# EAGLE schematic Front_Unit_5.4 (EAGLE 9.6.2), part 1 of 3
Assembly variants: A, B, C
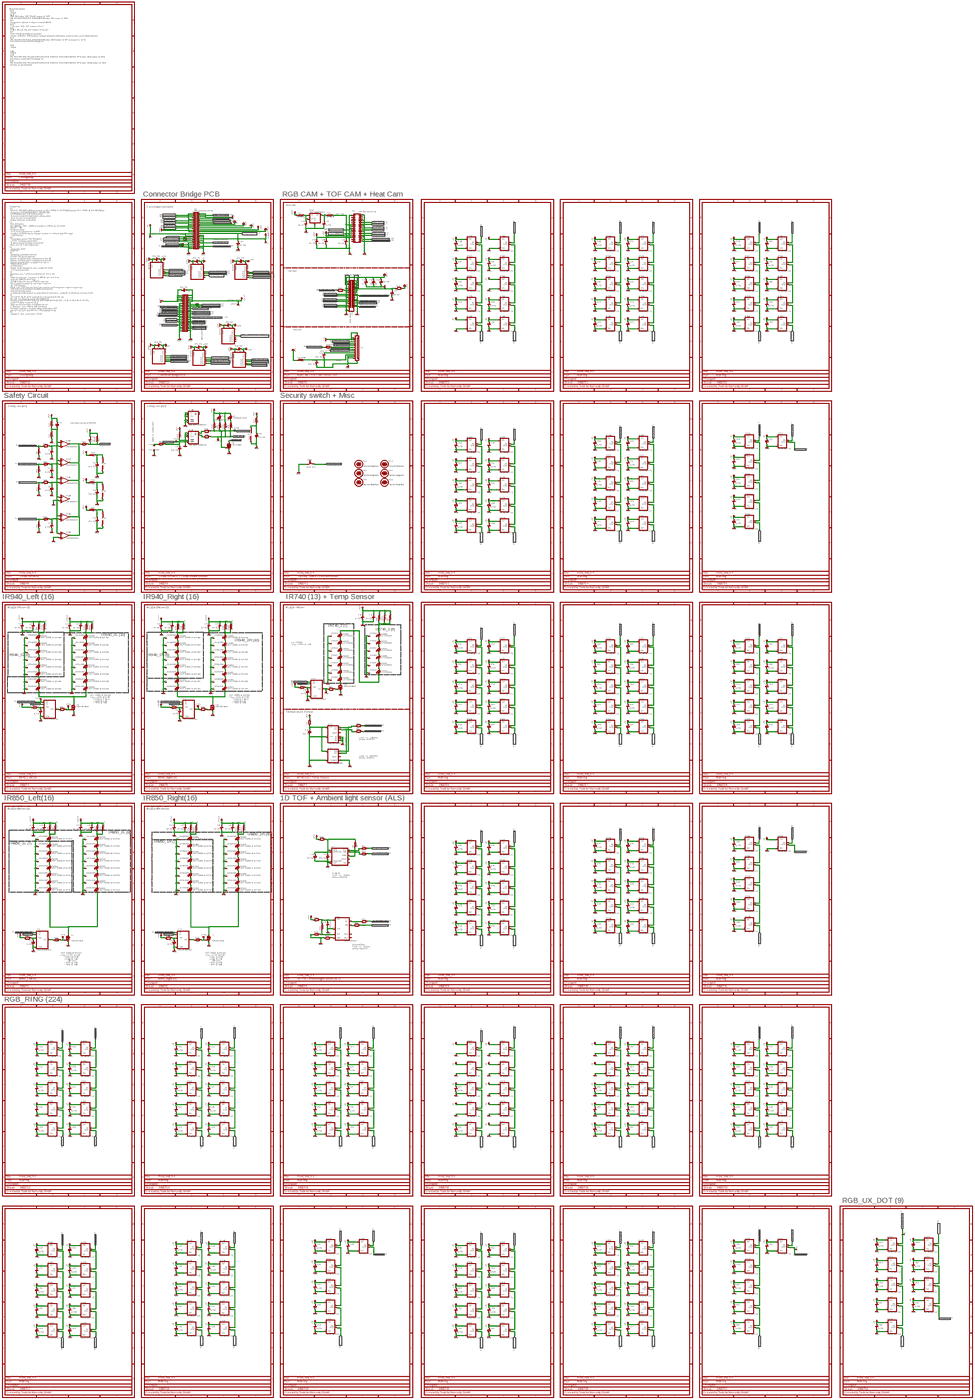
[diagram p0: schematic, sheet 1, overview]
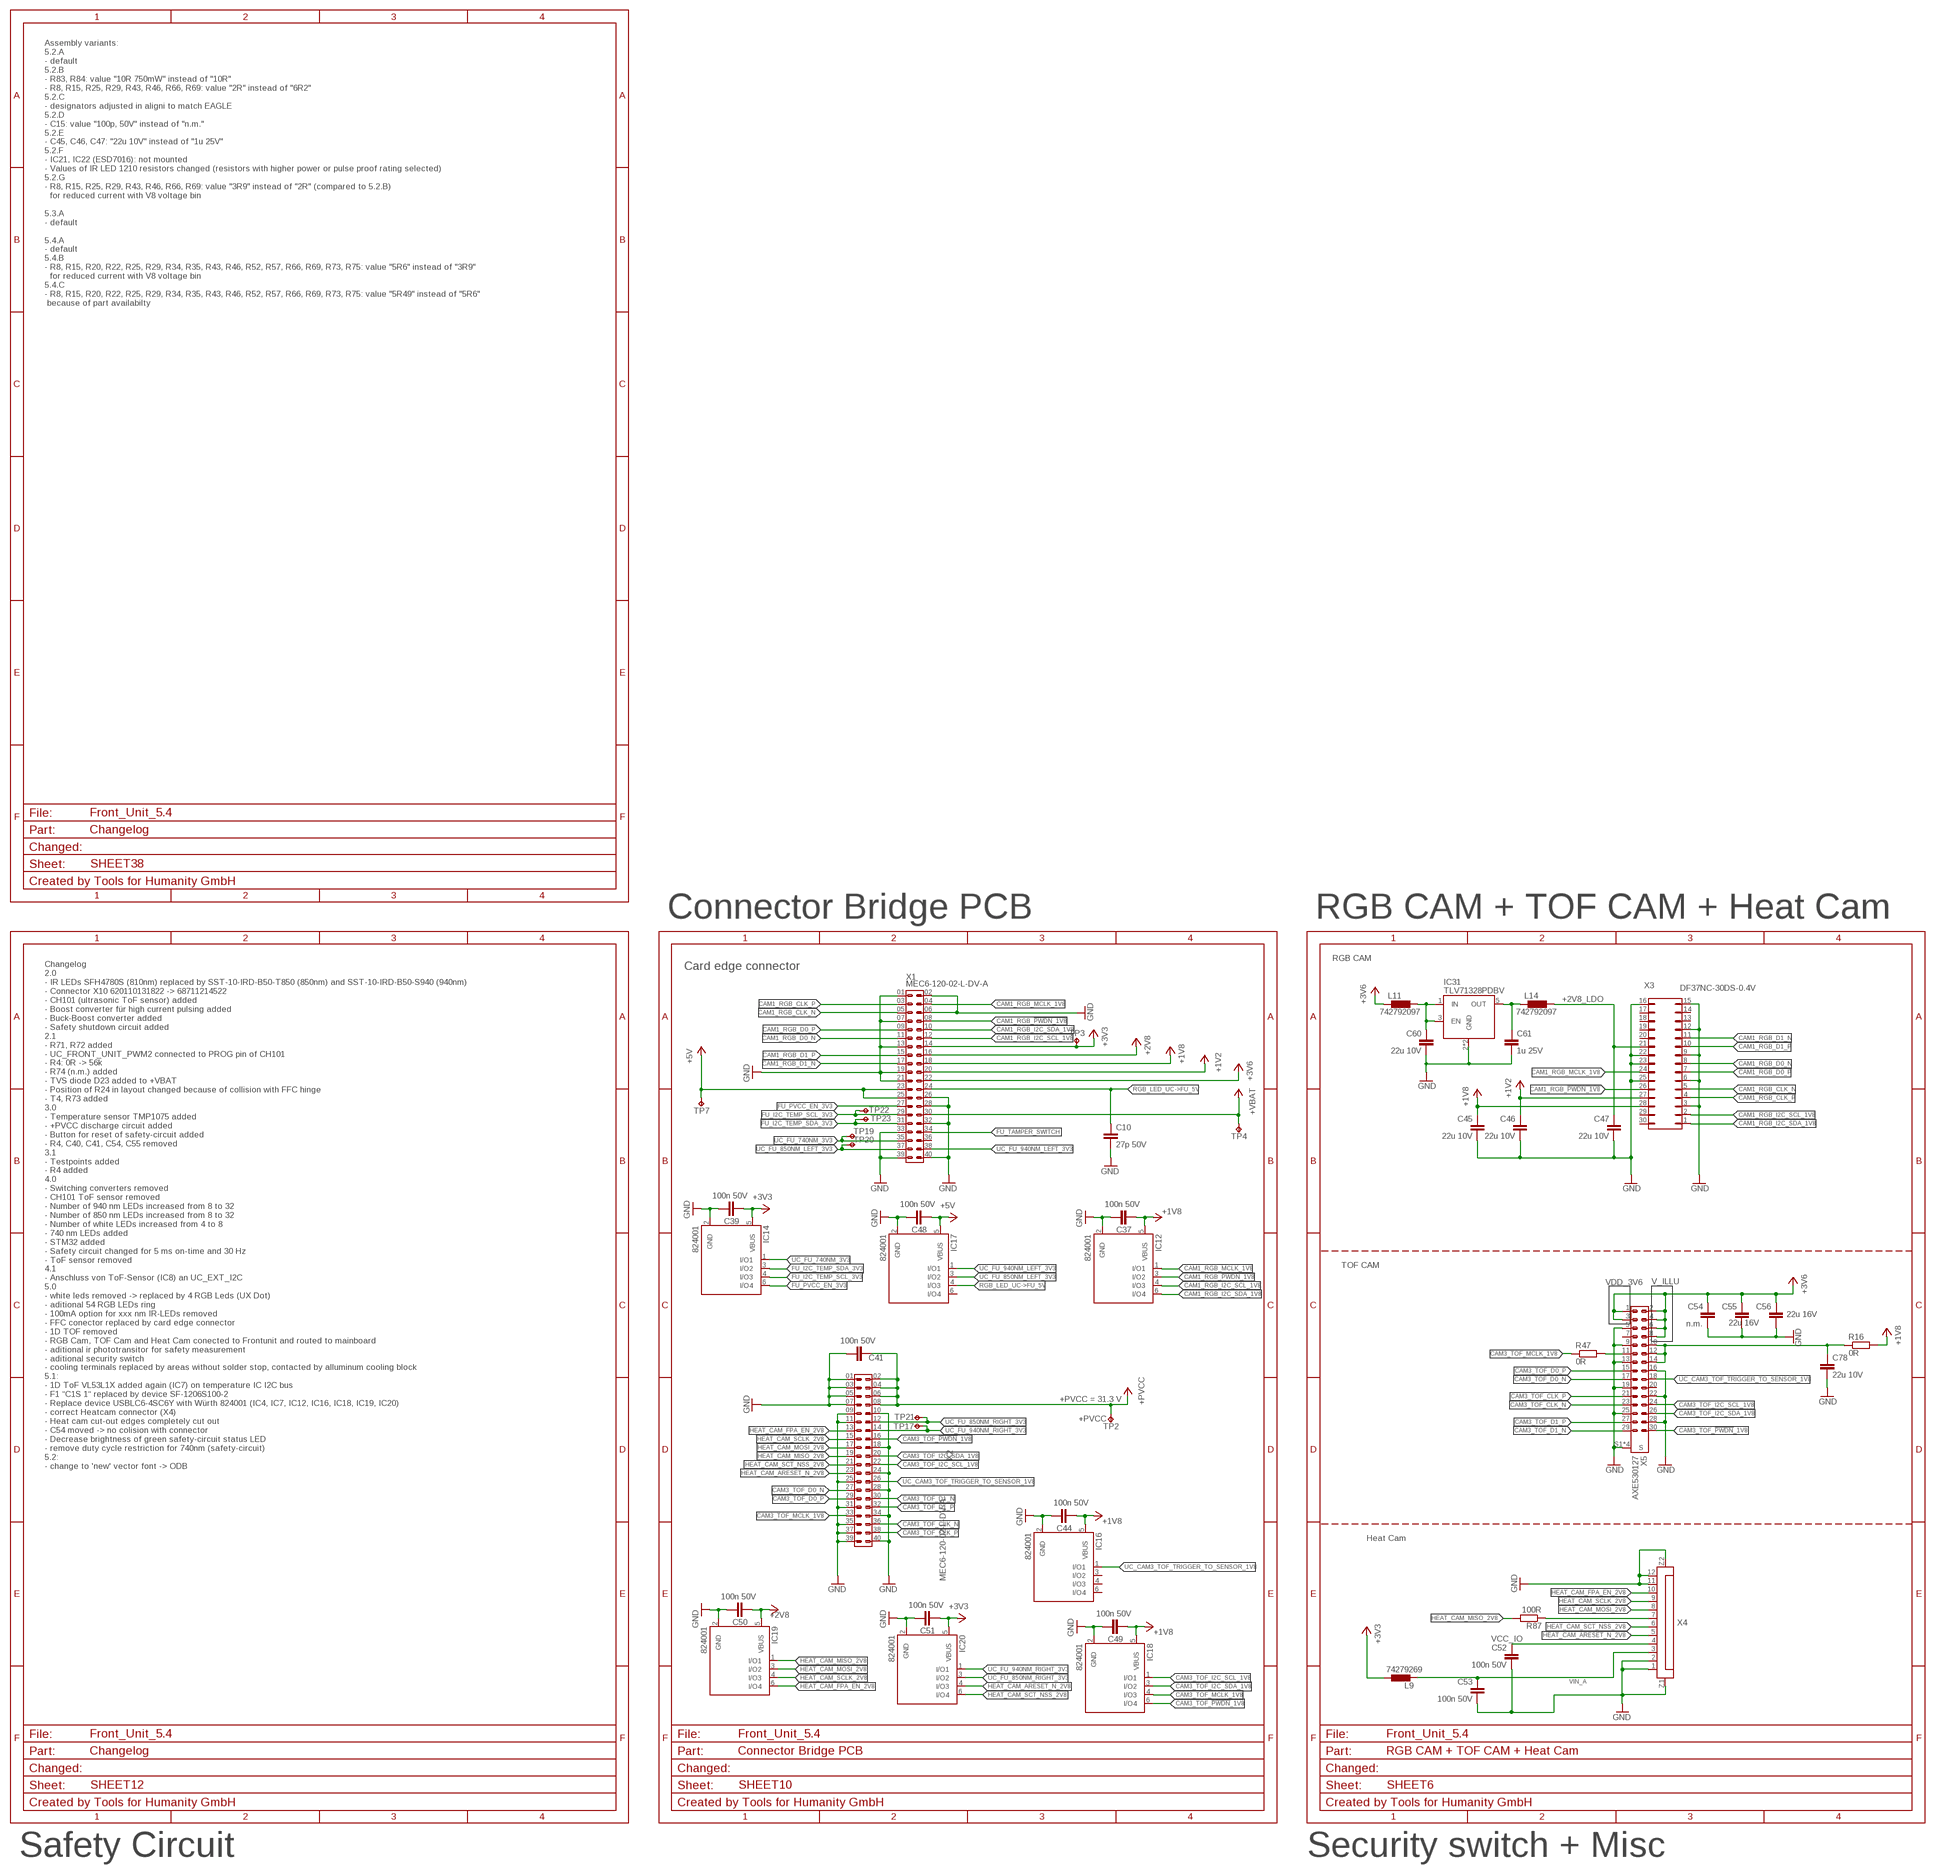
[diagram p1: schematic, sheet 1, part 1 of 8]
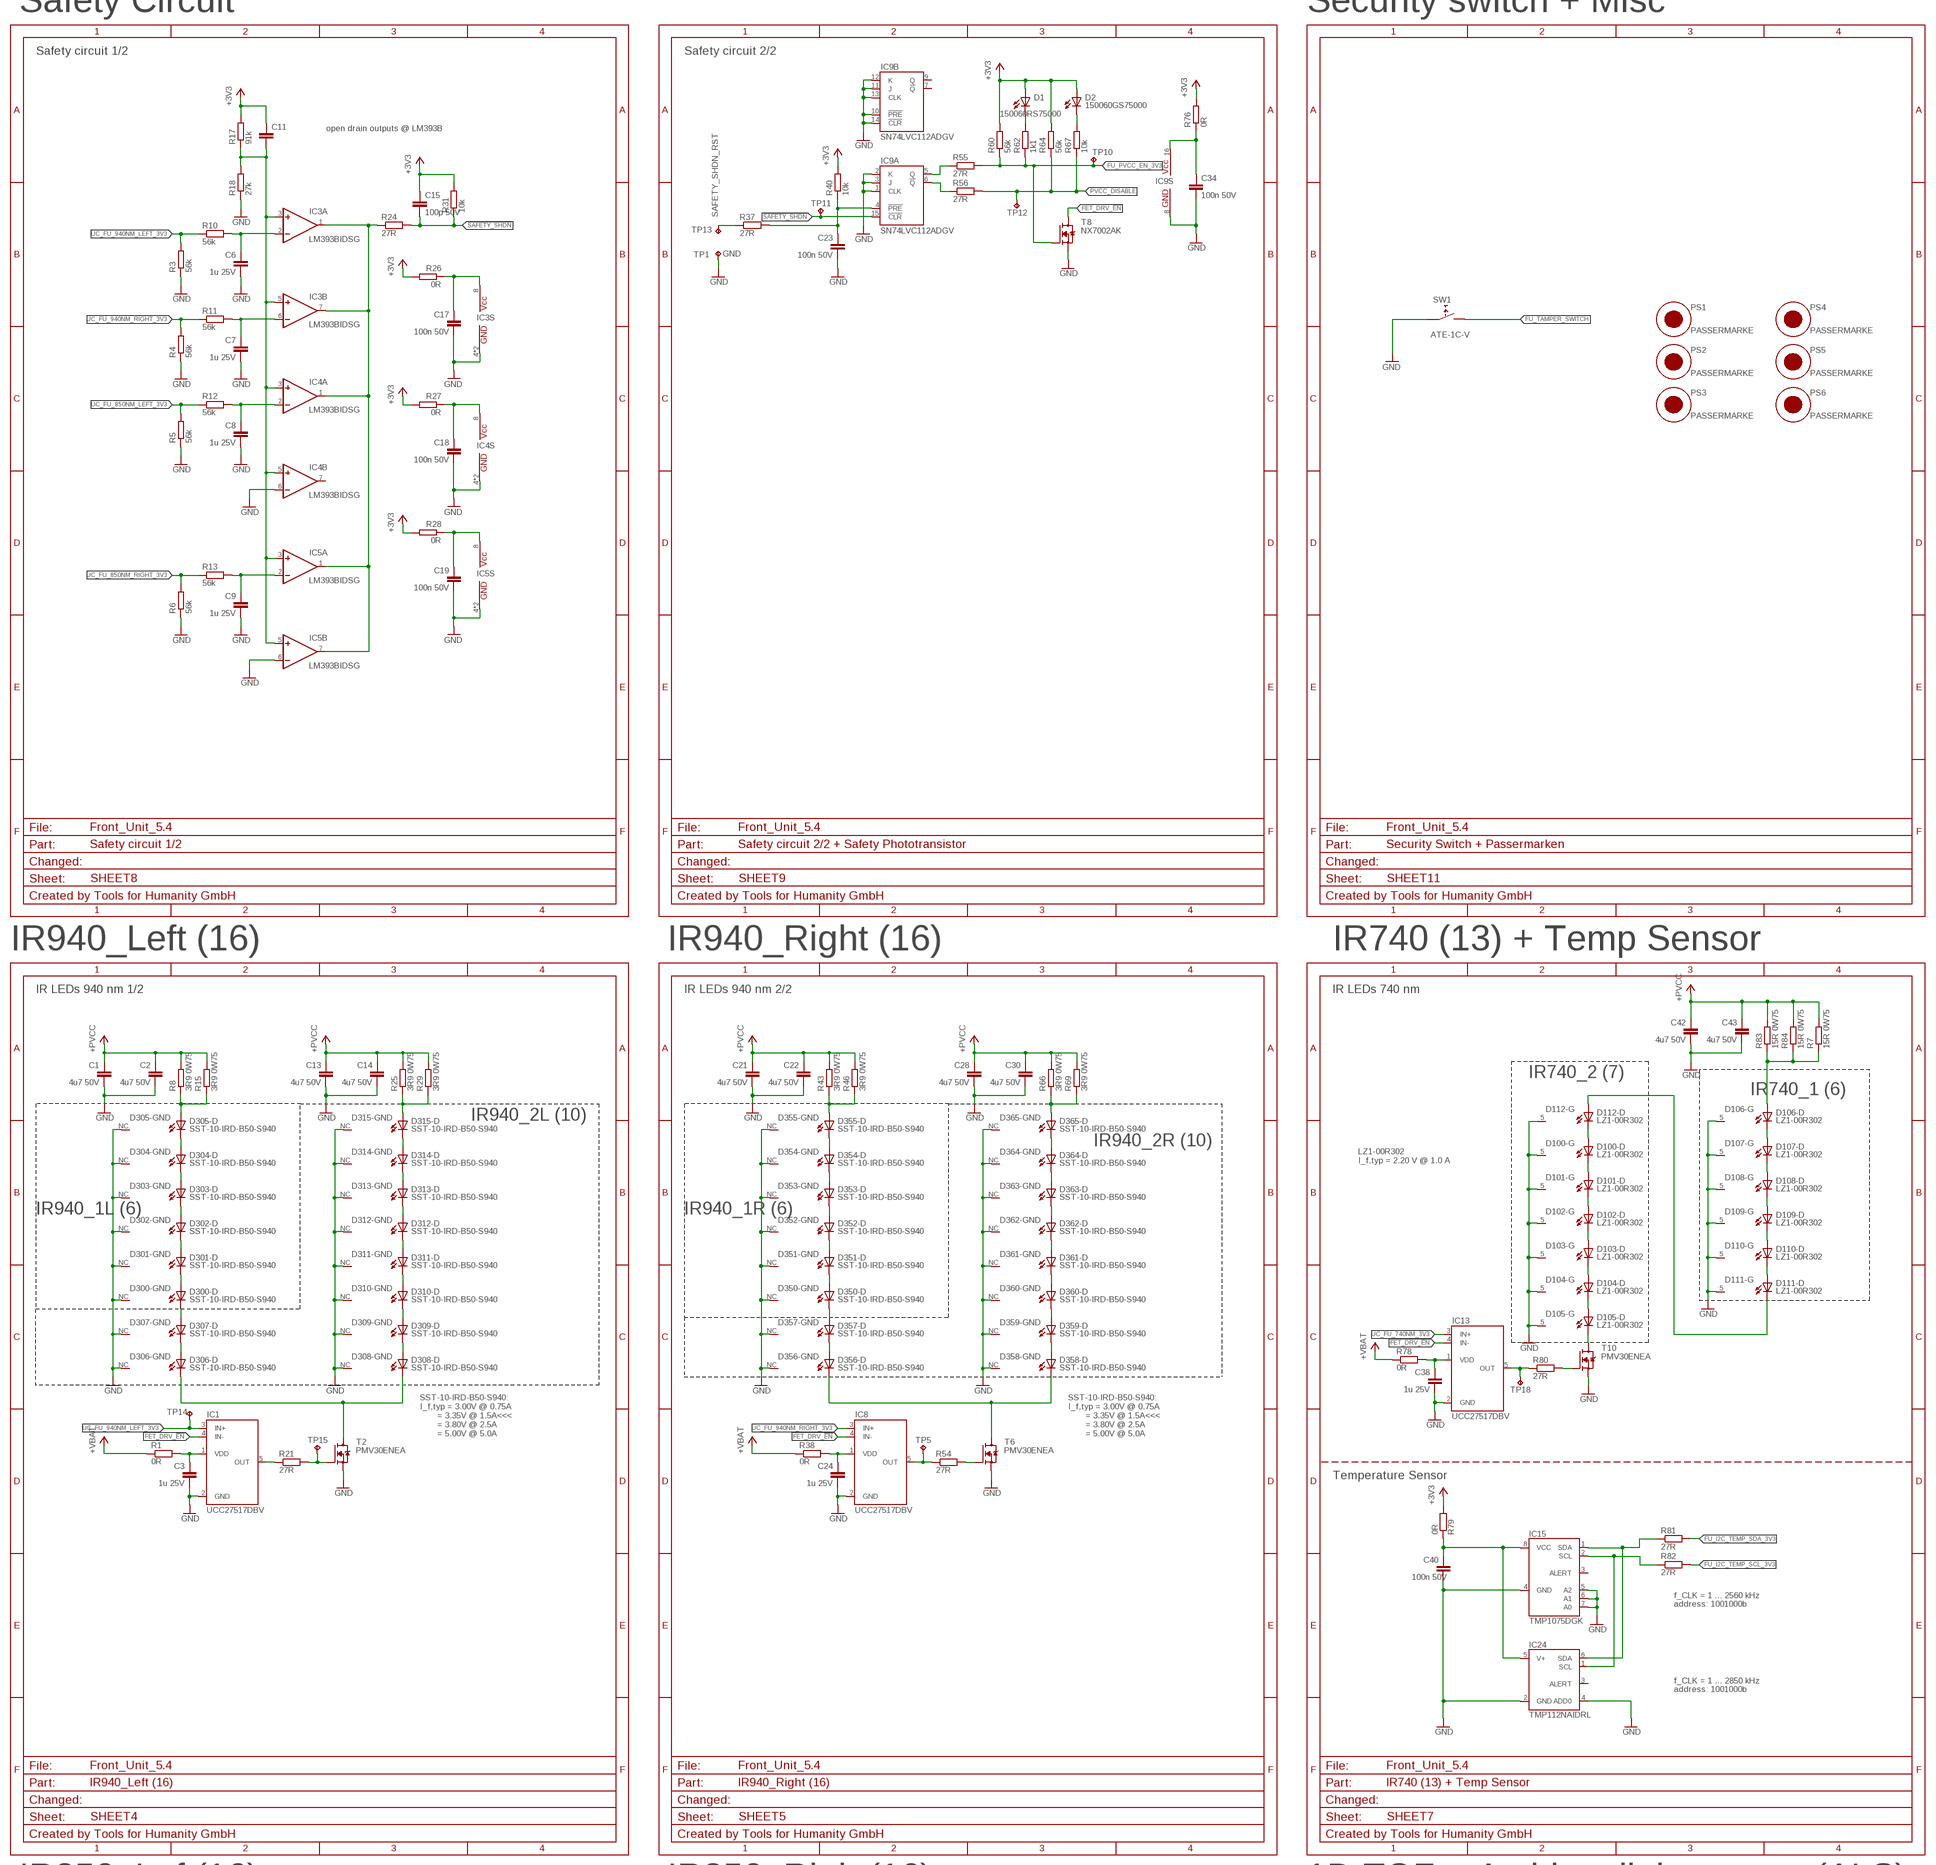
[diagram p2: schematic, sheet 1, part 2 of 8]
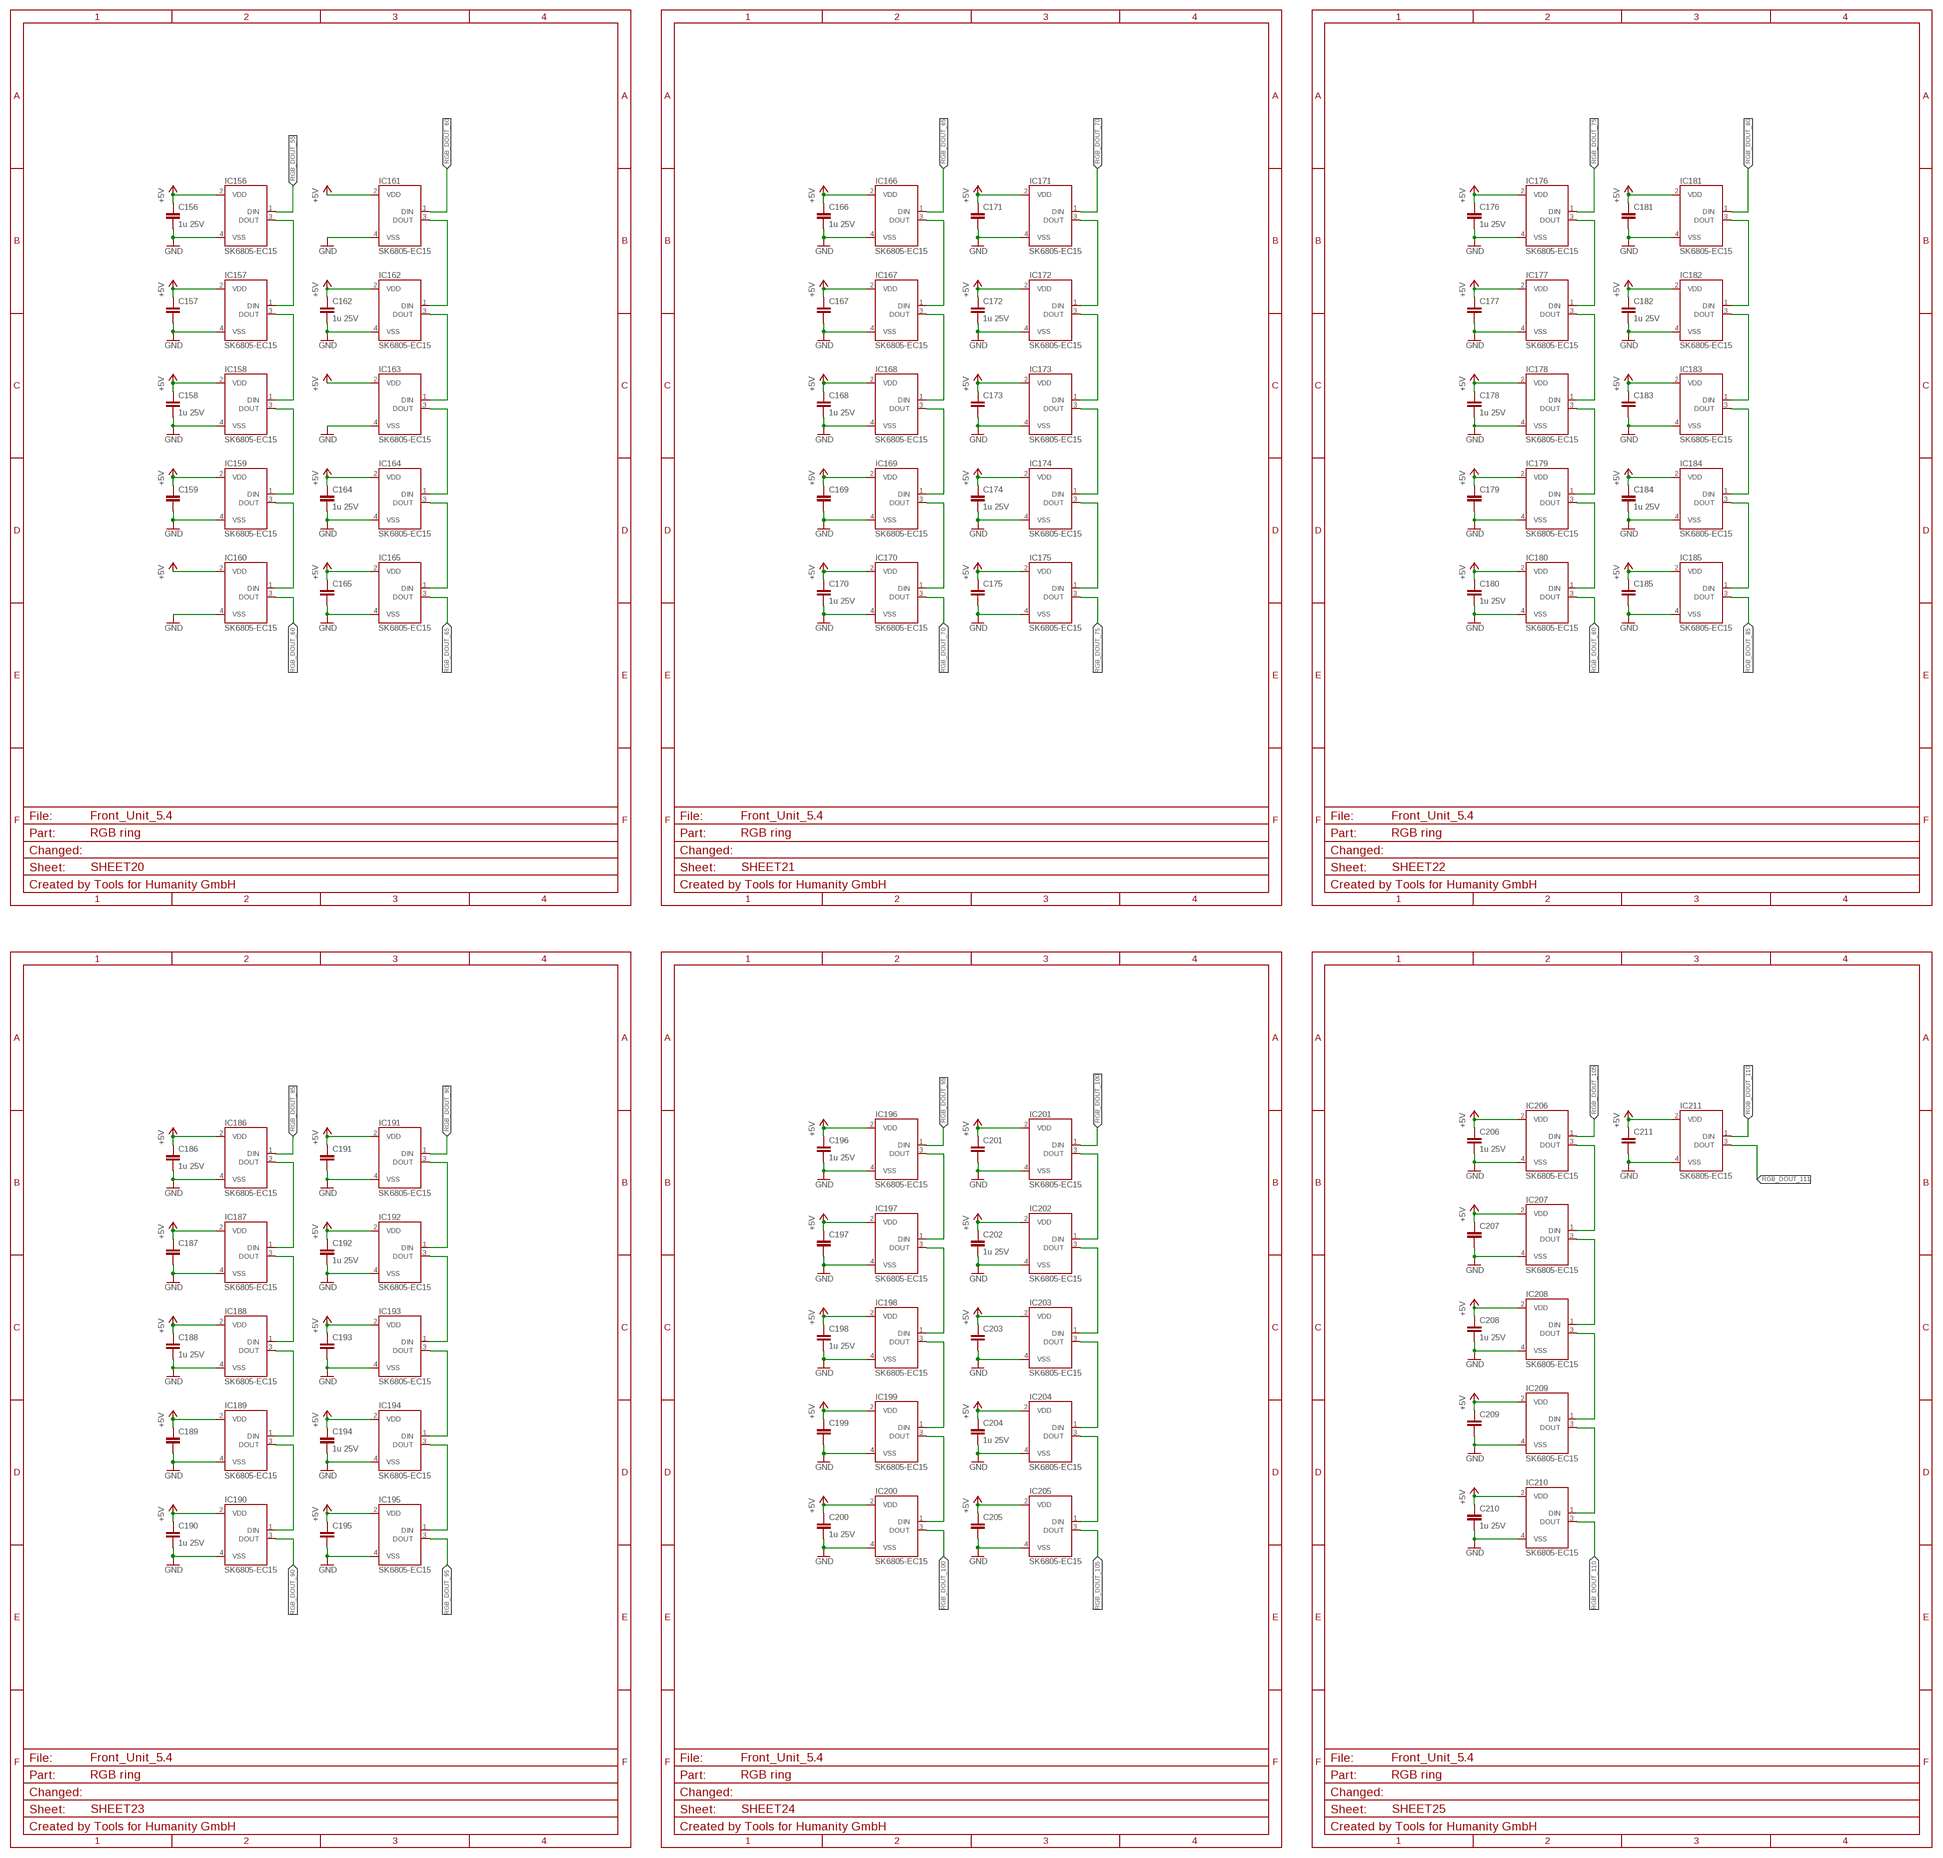
[diagram p3: schematic, sheet 1, part 3 of 8]
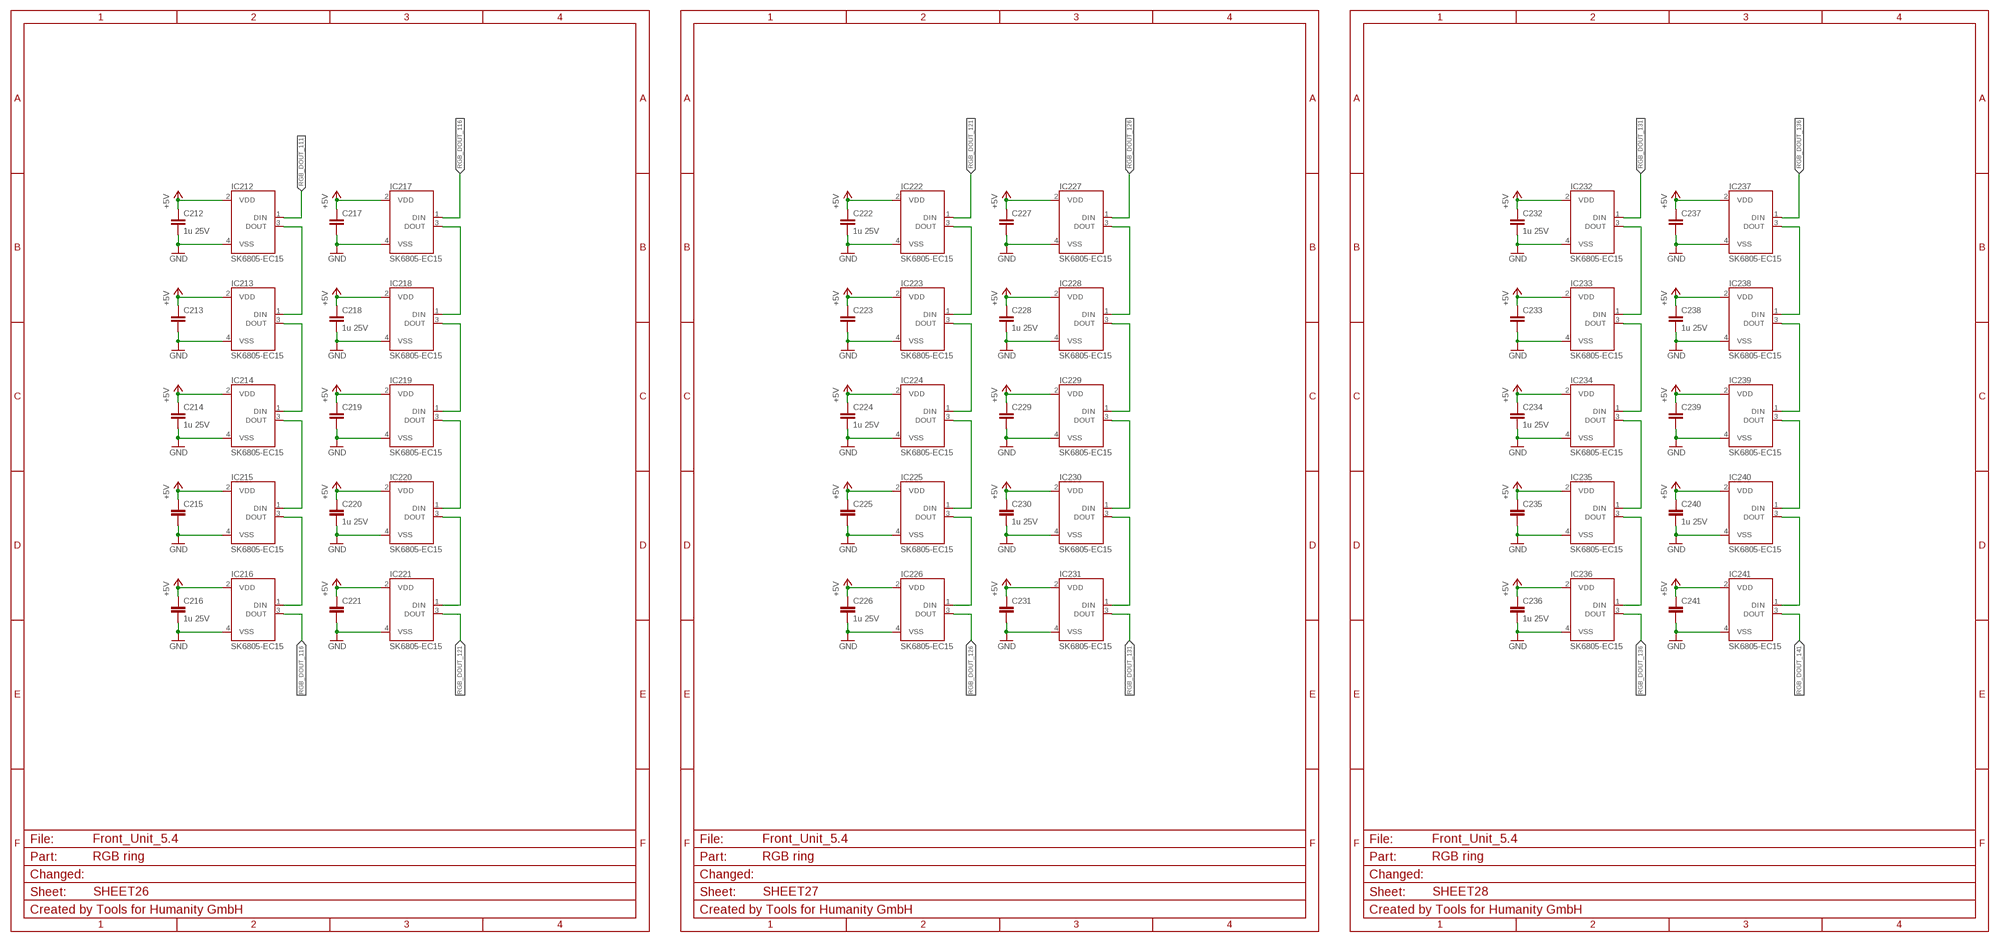
[diagram p4: schematic, sheet 1, part 4 of 8]
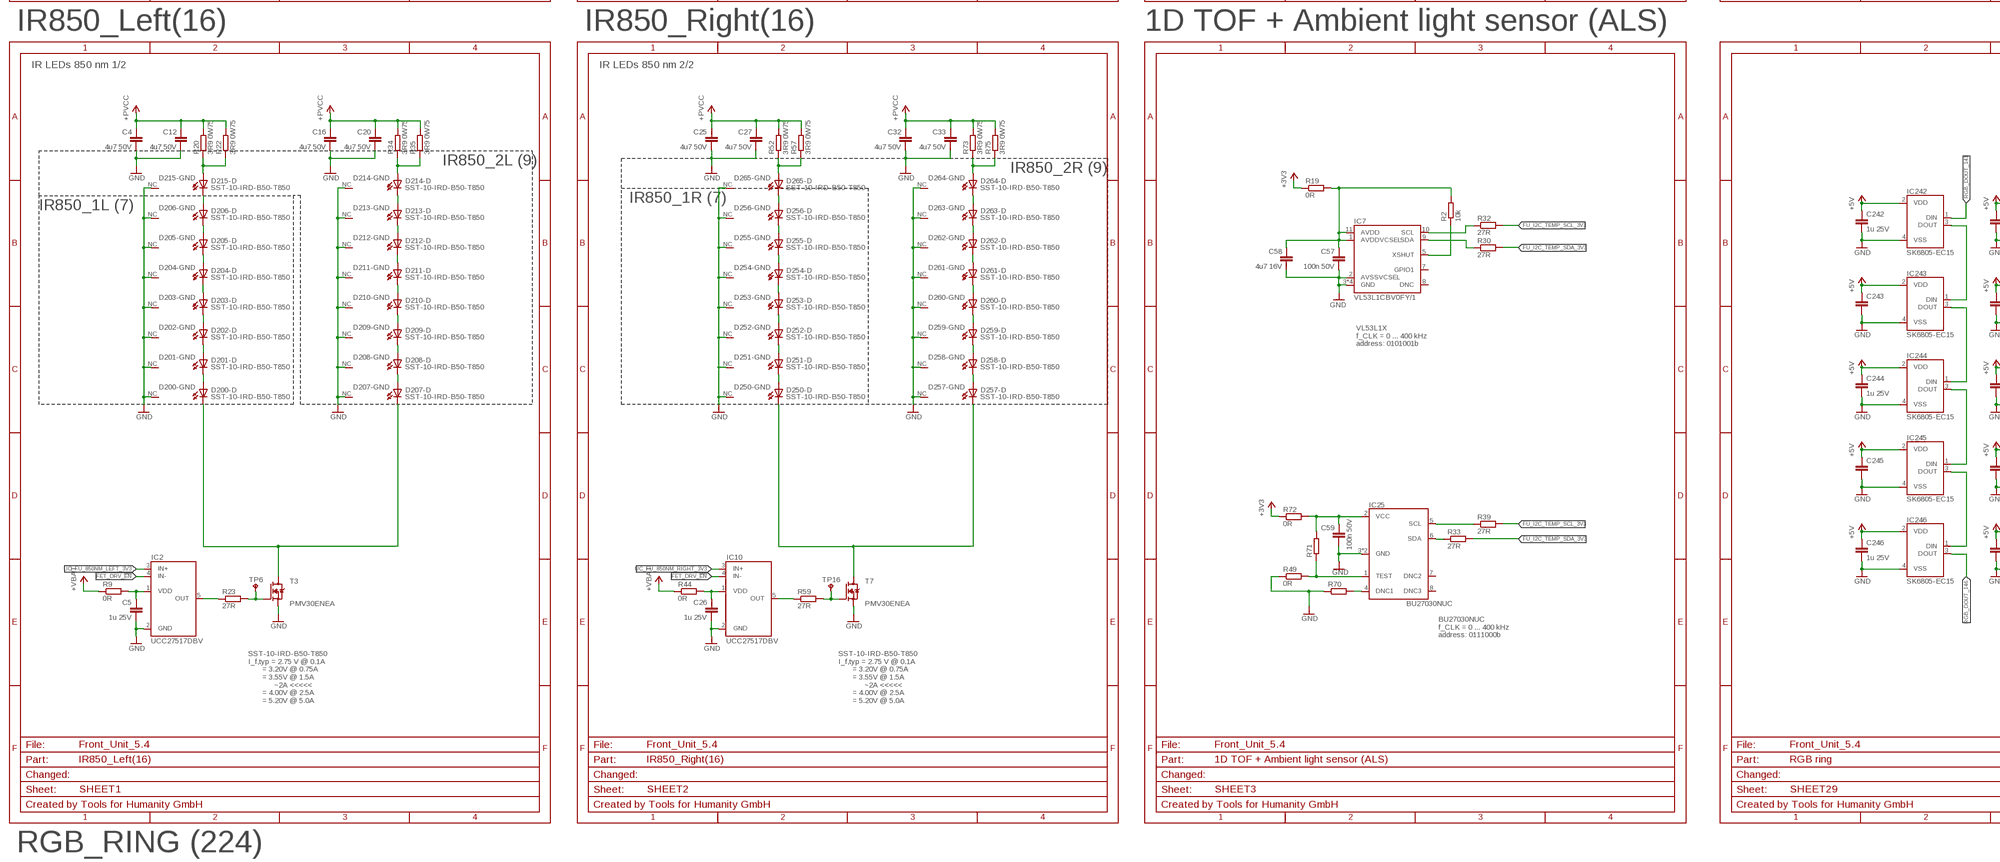
[diagram p5: schematic, sheet 1, part 5 of 8]
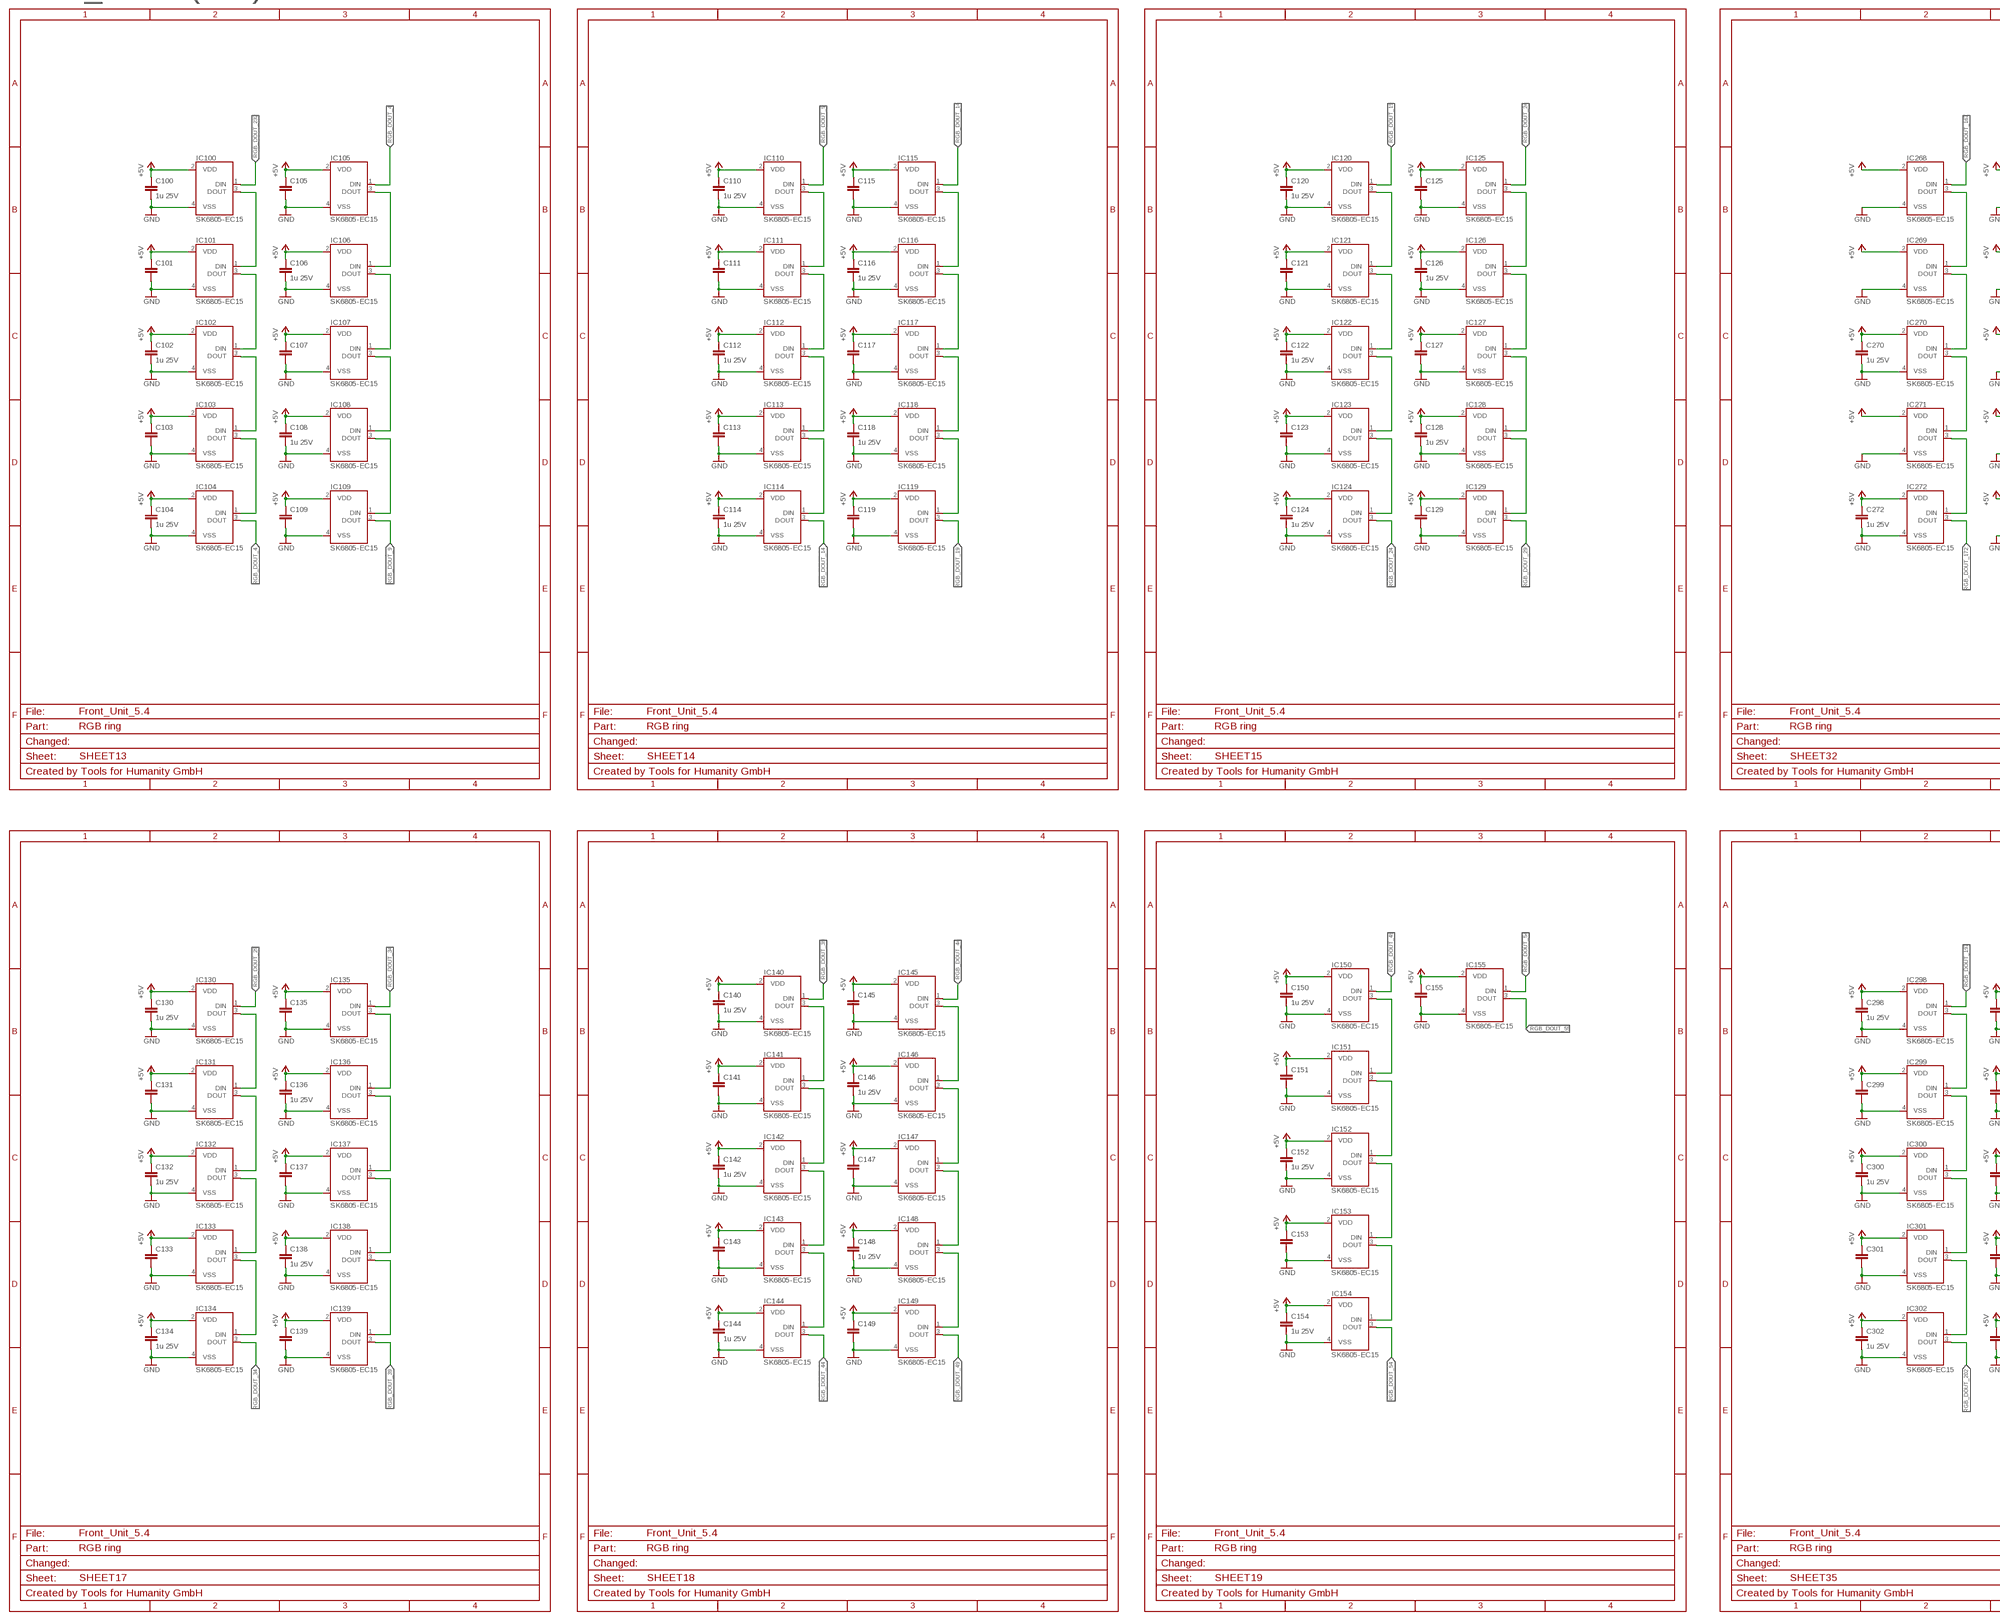
[diagram p6: schematic, sheet 1, part 6 of 8]
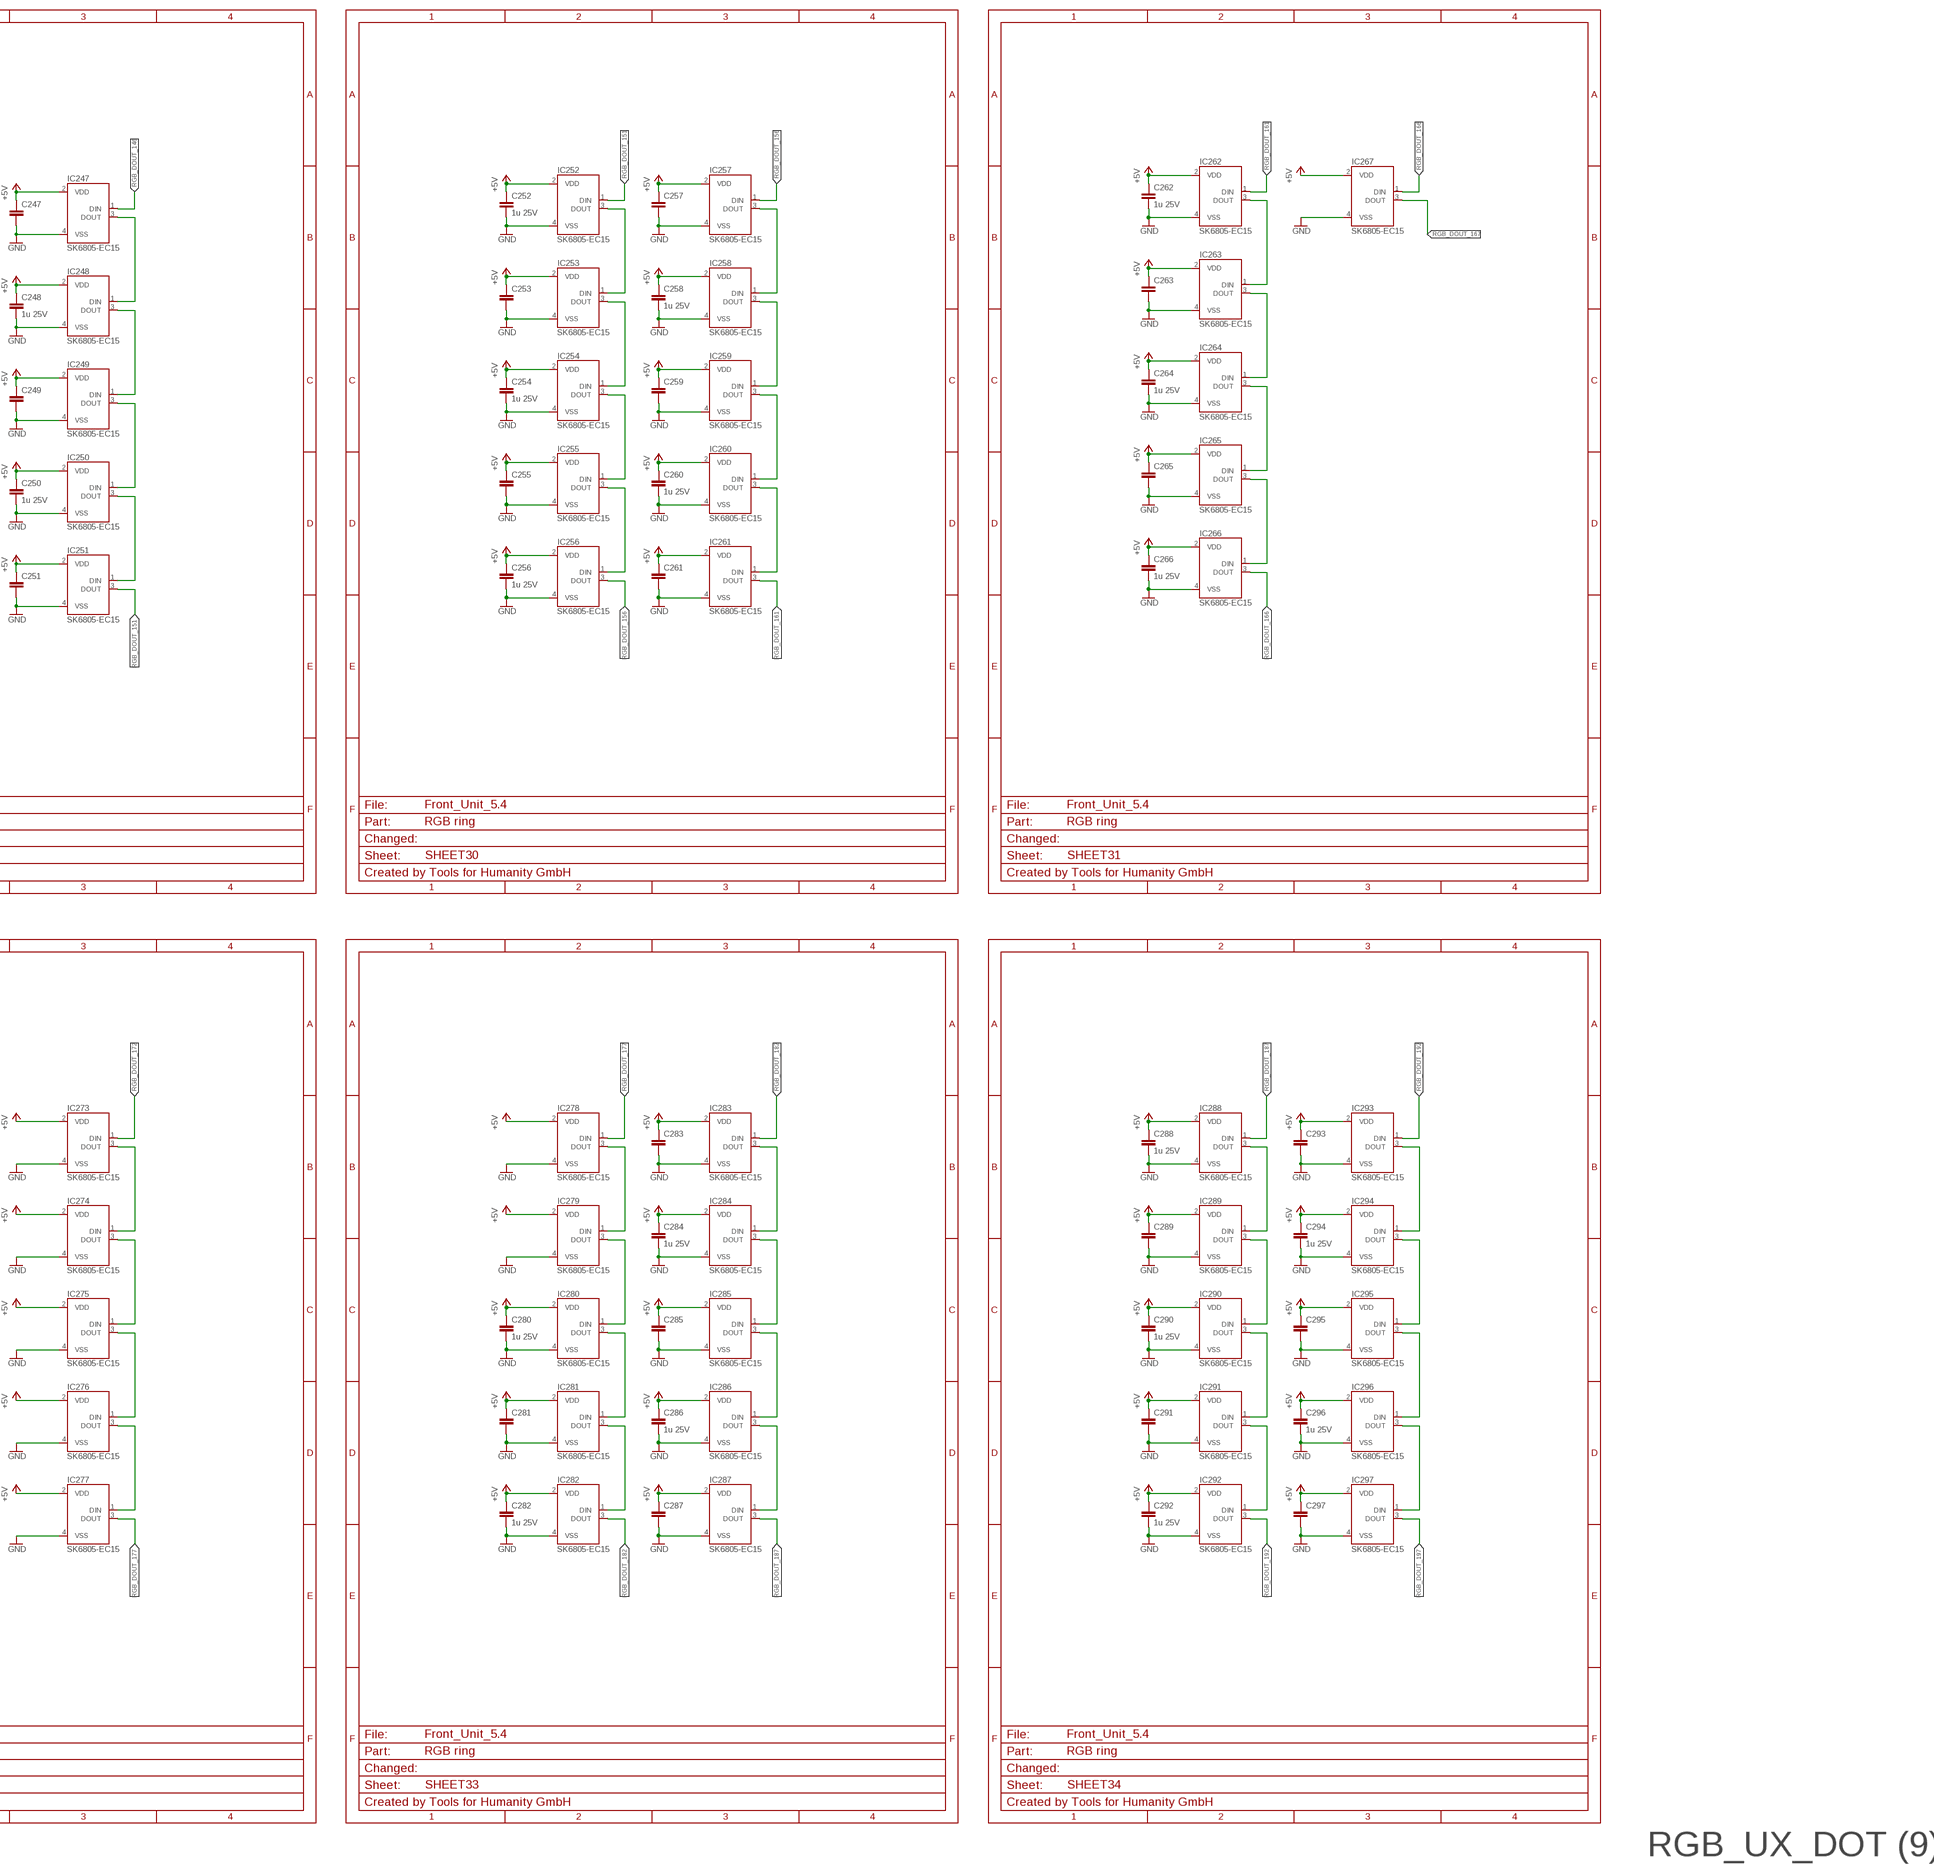
[diagram p7: schematic, sheet 1, part 7 of 8]
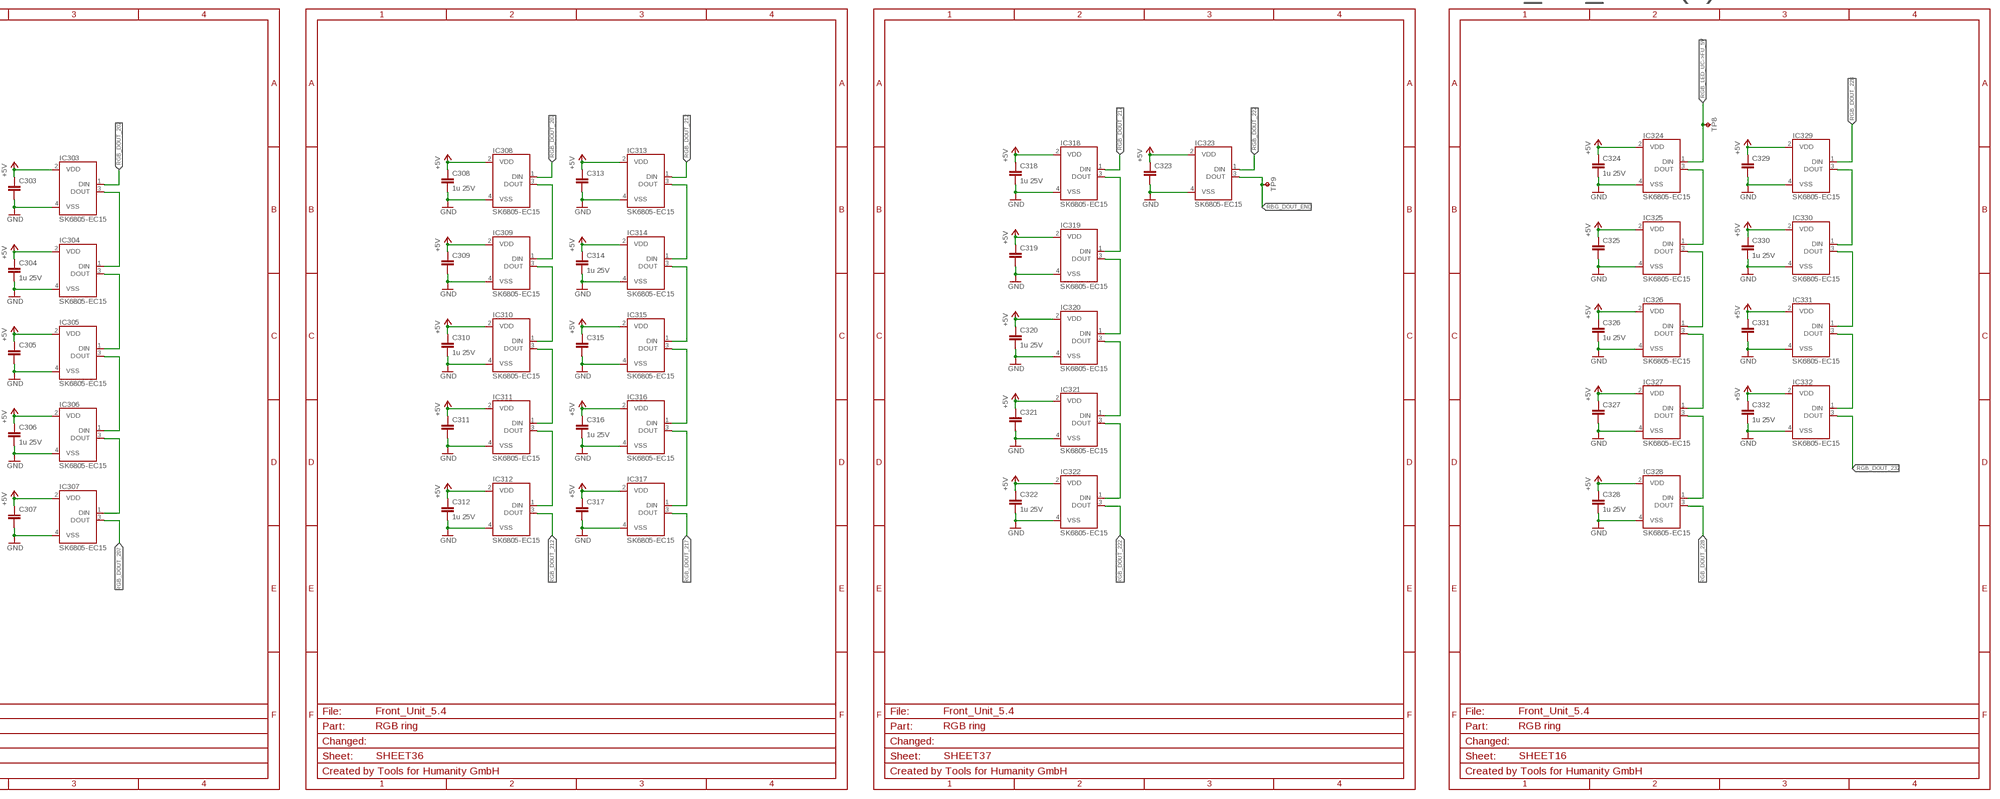
[diagram p8: schematic, sheet 1, part 8 of 8]

## Parts
C1  4u7 50V  C-EU-4U7-50V-C1210  [C1210]
C2  4u7 50V  C-EU-4U7-50V-C1210  [C1210]
C3  1u 25V  C-EU-1U-C0805  [C0805]
C4  4u7 50V  C-EU-4U7-50V-C1210  [C1210]
C5  1u 25V  C-EU-1U-C0805  [C0805]
C6  1u 25V  C-EU-1U-C0805  [C0805]
C7  1u 25V  C-EU-1U-C0805  [C0805]
C8  1u 25V  C-EU-1U-C0805  [C0805]
C9  1u 25V  C-EU-1U-C0805  [C0805]
C10  27p 50V  C-EU-27P-C0603  [C0603]
C11  C-EU-C0603  [C0603]  (not fitted in variant A)  (not fitted in variant B)  (not fitted in variant C)
C12  4u7 50V  C-EU-4U7-50V-C1210  [C1210]
C13  4u7 50V  C-EU-4U7-50V-C1210  [C1210]
C14  4u7 50V  C-EU-4U7-50V-C1210  [C1210]
C15  100p 50V  C-EU-100P-C0603  [C0603]
C16  4u7 50V  C-EU-4U7-50V-C1210  [C1210]
C17  100n 50V  C-EU-100N-C0603  [C0603]
C18  100n 50V  C-EU-100N-C0603  [C0603]
C19  100n 50V  C-EU-100N-C0603  [C0603]
C20  4u7 50V  C-EU-4U7-50V-C1210  [C1210]
C21  4u7 50V  C-EU-4U7-50V-C1210  [C1210]
C22  4u7 50V  C-EU-4U7-50V-C1210  [C1210]
C23  100n 50V  C-EU-100N-C0603  [C0603]
C24  1u 25V  C-EU-1U-C0805  [C0805]
C25  4u7 50V  C-EU-4U7-50V-C1210  [C1210]
C26  1u 25V  C-EU-1U-C0805  [C0805]
C27  4u7 50V  C-EU-4U7-50V-C1210  [C1210]
C28  4u7 50V  C-EU-4U7-50V-C1210  [C1210]
C30  4u7 50V  C-EU-4U7-50V-C1210  [C1210]
C32  4u7 50V  C-EU-4U7-50V-C1210  [C1210]
C33  4u7 50V  C-EU-4U7-50V-C1210  [C1210]
C34  100n 50V  C-EU-100N-C0603  [C0603]
C37  100n 50V  C-EU-100N-C0603  [C0603]
C38  1u 25V  C-EU-1U-C0805  [C0805]
C39  100n 50V  C-EU-100N-C0603  [C0603]
C40  100n 50V  C-EU-100N-C0603  [C0603]
C41  100n 50V  C-EU-100N-C0603  [C0603]
C42  4u7 50V  C-EU-4U7-50V-C1210  [C1210]
C43  4u7 50V  C-EU-4U7-50V-C1210  [C1210]
C44  100n 50V  C-EU-100N-C0603  [C0603]
C45  22u 10V  C-EU-22U-C0805  [C0805]
C46  22u 10V  C-EU-22U-C0805  [C0805]
C47  22u 10V  C-EU-22U-C0805  [C0805]
C48  100n 50V  C-EU-100N-C0603  [C0603]
C49  100n 50V  C-EU-100N-C0603  [C0603]
C50  100n 50V  C-EU-100N-C0603  [C0603]
C51  100n 50V  C-EU-100N-C0603  [C0603]
C52  100n 50V  C-EU-100N-C0603  [C0603]
C53  100n 50V  C-EU-100N-C0603  [C0603]
C54  n.m.  C-EU-C1206  [C1206]  (not fitted in variant A)  (not fitted in variant B)  (not fitted in variant C)
C55  22u 16V  C-EU-22U-C1206  [C1206]
C56  22u 16V  C-EU-22U-C1206  [C1206]
C57  100n 50V  C-EU-100N-C0603  [C0603]
C58  4u7 16V  C-EU-4U7-C0805  [C0805]
C59  100n 50V  C-EU-100N-C0603  [C0603]
C60  22u 10V  C-EU-22U-C0805  [C0805]
C61  1u 25V  C-EU-1U-C0603  [C0603]
C78  22u 10V  C-EU-22U-C0805  [C0805]
C100  1u 25V  C-EU-1U-C0603  [C0603]
C101  C-EU-C0603  [C0603]  (not fitted in variant A)  (not fitted in variant B)  (not fitted in variant C)
C102  1u 25V  C-EU-1U-C0603  [C0603]
C103  C-EU-C0603  [C0603]  (not fitted in variant A)  (not fitted in variant B)  (not fitted in variant C)
C104  1u 25V  C-EU-1U-C0603  [C0603]
C105  C-EU-C0603  [C0603]  (not fitted in variant A)  (not fitted in variant B)  (not fitted in variant C)
C106  1u 25V  C-EU-1U-C0603  [C0603]
C107  C-EU-C0603  [C0603]  (not fitted in variant A)  (not fitted in variant B)  (not fitted in variant C)
C108  1u 25V  C-EU-1U-C0603  [C0603]
C109  C-EU-C0603  [C0603]  (not fitted in variant A)  (not fitted in variant B)  (not fitted in variant C)
C110  1u 25V  C-EU-1U-C0603  [C0603]
C111  C-EU-C0603  [C0603]  (not fitted in variant A)  (not fitted in variant B)  (not fitted in variant C)
C112  1u 25V  C-EU-1U-C0603  [C0603]
C113  C-EU-C0603  [C0603]  (not fitted in variant A)  (not fitted in variant B)  (not fitted in variant C)
C114  1u 25V  C-EU-1U-C0603  [C0603]
C115  C-EU-C0603  [C0603]  (not fitted in variant A)  (not fitted in variant B)  (not fitted in variant C)
C116  1u 25V  C-EU-1U-C0603  [C0603]
C117  C-EU-C0603  [C0603]  (not fitted in variant A)  (not fitted in variant B)  (not fitted in variant C)
C118  1u 25V  C-EU-1U-C0603  [C0603]
C119  C-EU-C0603  [C0603]  (not fitted in variant A)  (not fitted in variant B)  (not fitted in variant C)
C120  1u 25V  C-EU-1U-C0603  [C0603]
C121  C-EU-C0603  [C0603]  (not fitted in variant A)  (not fitted in variant B)  (not fitted in variant C)
C122  1u 25V  C-EU-1U-C0603  [C0603]
C123  C-EU-C0603  [C0603]  (not fitted in variant A)  (not fitted in variant B)  (not fitted in variant C)
C124  1u 25V  C-EU-1U-C0603  [C0603]
C125  C-EU-C0603  [C0603]  (not fitted in variant A)  (not fitted in variant B)  (not fitted in variant C)
C126  1u 25V  C-EU-1U-C0603  [C0603]
C127  C-EU-C0603  [C0603]  (not fitted in variant A)  (not fitted in variant B)  (not fitted in variant C)
C128  1u 25V  C-EU-1U-C0603  [C0603]
C129  C-EU-C0603  [C0603]  (not fitted in variant A)  (not fitted in variant B)  (not fitted in variant C)
C130  1u 25V  C-EU-1U-C0603  [C0603]
C131  C-EU-C0603  [C0603]  (not fitted in variant A)  (not fitted in variant B)  (not fitted in variant C)
C132  1u 25V  C-EU-1U-C0603  [C0603]
C133  C-EU-C0603  [C0603]  (not fitted in variant A)  (not fitted in variant B)  (not fitted in variant C)
C134  1u 25V  C-EU-1U-C0603  [C0603]
C135  C-EU-C0603  [C0603]  (not fitted in variant A)  (not fitted in variant B)  (not fitted in variant C)
C136  1u 25V  C-EU-1U-C0603  [C0603]
C137  C-EU-C0603  [C0603]  (not fitted in variant A)  (not fitted in variant B)  (not fitted in variant C)
C138  1u 25V  C-EU-1U-C0603  [C0603]
C139  C-EU-C0603  [C0603]  (not fitted in variant A)  (not fitted in variant B)  (not fitted in variant C)
C140  1u 25V  C-EU-1U-C0603  [C0603]
C141  C-EU-C0603  [C0603]  (not fitted in variant A)  (not fitted in variant B)  (not fitted in variant C)
C142  1u 25V  C-EU-1U-C0603  [C0603]
C143  C-EU-C0603  [C0603]  (not fitted in variant A)  (not fitted in variant B)  (not fitted in variant C)
C144  1u 25V  C-EU-1U-C0603  [C0603]
C145  C-EU-C0603  [C0603]  (not fitted in variant A)  (not fitted in variant B)  (not fitted in variant C)
C146  1u 25V  C-EU-1U-C0603  [C0603]
C147  C-EU-C0603  [C0603]  (not fitted in variant A)  (not fitted in variant B)  (not fitted in variant C)
C148  1u 25V  C-EU-1U-C0603  [C0603]
C149  C-EU-C0603  [C0603]  (not fitted in variant A)  (not fitted in variant B)  (not fitted in variant C)
C150  1u 25V  C-EU-1U-C0603  [C0603]
C151  C-EU-C0603  [C0603]  (not fitted in variant A)  (not fitted in variant B)  (not fitted in variant C)
C152  1u 25V  C-EU-1U-C0603  [C0603]
C153  C-EU-C0603  [C0603]  (not fitted in variant A)  (not fitted in variant B)  (not fitted in variant C)
C154  1u 25V  C-EU-1U-C0603  [C0603]
C155  C-EU-C0603  [C0603]  (not fitted in variant A)  (not fitted in variant B)  (not fitted in variant C)
C156  1u 25V  C-EU-1U-C0603  [C0603]
C157  C-EU-C0603  [C0603]  (not fitted in variant A)  (not fitted in variant B)  (not fitted in variant C)
C158  1u 25V  C-EU-1U-C0603  [C0603]
C159  C-EU-C0603  [C0603]  (not fitted in variant A)  (not fitted in variant B)  (not fitted in variant C)
C162  1u 25V  C-EU-1U-C0603  [C0603]
C164  1u 25V  C-EU-1U-C0603  [C0603]
C165  C-EU-C0603  [C0603]  (not fitted in variant A)  (not fitted in variant B)  (not fitted in variant C)
C166  1u 25V  C-EU-1U-C0603  [C0603]
C167  C-EU-C0603  [C0603]  (not fitted in variant A)  (not fitted in variant B)  (not fitted in variant C)
C168  1u 25V  C-EU-1U-C0603  [C0603]
C169  C-EU-C0603  [C0603]  (not fitted in variant A)  (not fitted in variant B)  (not fitted in variant C)
C170  1u 25V  C-EU-1U-C0603  [C0603]
C171  C-EU-C0603  [C0603]  (not fitted in variant A)  (not fitted in variant B)  (not fitted in variant C)
C172  1u 25V  C-EU-1U-C0603  [C0603]
C173  C-EU-C0603  [C0603]  (not fitted in variant A)  (not fitted in variant B)  (not fitted in variant C)
C174  1u 25V  C-EU-1U-C0603  [C0603]
C175  C-EU-C0603  [C0603]  (not fitted in variant A)  (not fitted in variant B)  (not fitted in variant C)
C176  1u 25V  C-EU-1U-C0603  [C0603]
C177  C-EU-C0603  [C0603]  (not fitted in variant A)  (not fitted in variant B)  (not fitted in variant C)
C178  1u 25V  C-EU-1U-C0603  [C0603]
C179  C-EU-C0603  [C0603]  (not fitted in variant A)  (not fitted in variant B)  (not fitted in variant C)
C180  1u 25V  C-EU-1U-C0603  [C0603]
C181  C-EU-C0603  [C0603]  (not fitted in variant A)  (not fitted in variant B)  (not fitted in variant C)
C182  1u 25V  C-EU-1U-C0603  [C0603]
C183  C-EU-C0603  [C0603]  (not fitted in variant A)  (not fitted in variant B)  (not fitted in variant C)
C184  1u 25V  C-EU-1U-C0603  [C0603]
C185  C-EU-C0603  [C0603]  (not fitted in variant A)  (not fitted in variant B)  (not fitted in variant C)
C186  1u 25V  C-EU-1U-C0603  [C0603]
C187  C-EU-C0603  [C0603]  (not fitted in variant A)  (not fitted in variant B)  (not fitted in variant C)
C188  1u 25V  C-EU-1U-C0603  [C0603]
C189  C-EU-C0603  [C0603]  (not fitted in variant A)  (not fitted in variant B)  (not fitted in variant C)
C190  1u 25V  C-EU-1U-C0603  [C0603]
C191  C-EU-C0603  [C0603]  (not fitted in variant A)  (not fitted in variant B)  (not fitted in variant C)
C192  1u 25V  C-EU-1U-C0603  [C0603]
C193  C-EU-C0603  [C0603]  (not fitted in variant A)  (not fitted in variant B)  (not fitted in variant C)
C194  1u 25V  C-EU-1U-C0603  [C0603]
C195  C-EU-C0603  [C0603]  (not fitted in variant A)  (not fitted in variant B)  (not fitted in variant C)
C196  1u 25V  C-EU-1U-C0603  [C0603]
C197  C-EU-C0603  [C0603]  (not fitted in variant A)  (not fitted in variant B)  (not fitted in variant C)
C198  1u 25V  C-EU-1U-C0603  [C0603]
C199  C-EU-C0603  [C0603]  (not fitted in variant A)  (not fitted in variant B)  (not fitted in variant C)
C200  1u 25V  C-EU-1U-C0603  [C0603]
C201  C-EU-C0603  [C0603]  (not fitted in variant A)  (not fitted in variant B)  (not fitted in variant C)
C202  1u 25V  C-EU-1U-C0603  [C0603]
C203  C-EU-C0603  [C0603]  (not fitted in variant A)  (not fitted in variant B)  (not fitted in variant C)
C204  1u 25V  C-EU-1U-C0603  [C0603]
C205  C-EU-C0603  [C0603]  (not fitted in variant A)  (not fitted in variant B)  (not fitted in variant C)
C206  1u 25V  C-EU-1U-C0603  [C0603]
C207  C-EU-C0603  [C0603]  (not fitted in variant A)  (not fitted in variant B)  (not fitted in variant C)
C208  1u 25V  C-EU-1U-C0603  [C0603]
C209  C-EU-C0603  [C0603]  (not fitted in variant A)  (not fitted in variant B)  (not fitted in variant C)
C210  1u 25V  C-EU-1U-C0603  [C0603]
C211  C-EU-C0603  [C0603]  (not fitted in variant A)  (not fitted in variant B)  (not fitted in variant C)
C212  1u 25V  C-EU-1U-C0603  [C0603]
C213  C-EU-C0603  [C0603]  (not fitted in variant A)  (not fitted in variant B)  (not fitted in variant C)
C214  1u 25V  C-EU-1U-C0603  [C0603]
C215  C-EU-C0603  [C0603]  (not fitted in variant A)  (not fitted in variant B)  (not fitted in variant C)
C216  1u 25V  C-EU-1U-C0603  [C0603]
C217  C-EU-C0603  [C0603]  (not fitted in variant A)  (not fitted in variant B)  (not fitted in variant C)
C218  1u 25V  C-EU-1U-C0603  [C0603]
C219  C-EU-C0603  [C0603]  (not fitted in variant A)  (not fitted in variant B)  (not fitted in variant C)
C220  1u 25V  C-EU-1U-C0603  [C0603]
C221  C-EU-C0603  [C0603]  (not fitted in variant A)  (not fitted in variant B)  (not fitted in variant C)
C222  1u 25V  C-EU-1U-C0603  [C0603]
C223  C-EU-C0603  [C0603]  (not fitted in variant A)  (not fitted in variant B)  (not fitted in variant C)
C224  1u 25V  C-EU-1U-C0603  [C0603]
C225  C-EU-C0603  [C0603]  (not fitted in variant A)  (not fitted in variant B)  (not fitted in variant C)
C226  1u 25V  C-EU-1U-C0603  [C0603]
C227  C-EU-C0603  [C0603]  (not fitted in variant A)  (not fitted in variant B)  (not fitted in variant C)
C228  1u 25V  C-EU-1U-C0603  [C0603]
C229  C-EU-C0603  [C0603]  (not fitted in variant A)  (not fitted in variant B)  (not fitted in variant C)
C230  1u 25V  C-EU-1U-C0603  [C0603]
C231  C-EU-C0603  [C0603]  (not fitted in variant A)  (not fitted in variant B)  (not fitted in variant C)
C232  1u 25V  C-EU-1U-C0603  [C0603]
C233  C-EU-C0603  [C0603]  (not fitted in variant A)  (not fitted in variant B)  (not fitted in variant C)
C234  1u 25V  C-EU-1U-C0603  [C0603]
C235  C-EU-C0603  [C0603]  (not fitted in variant A)  (not fitted in variant B)  (not fitted in variant C)
C236  1u 25V  C-EU-1U-C0603  [C0603]
C237  C-EU-C0603  [C0603]  (not fitted in variant A)  (not fitted in variant B)  (not fitted in variant C)
C238  1u 25V  C-EU-1U-C0603  [C0603]
C239  C-EU-C0603  [C0603]  (not fitted in variant A)  (not fitted in variant B)  (not fitted in variant C)
C240  1u 25V  C-EU-1U-C0603  [C0603]
C241  C-EU-C0603  [C0603]  (not fitted in variant A)  (not fitted in variant B)  (not fitted in variant C)
C242  1u 25V  C-EU-1U-C0603  [C0603]
C243  C-EU-C0603  [C0603]  (not fitted in variant A)  (not fitted in variant B)  (not fitted in variant C)
C244  1u 25V  C-EU-1U-C0603  [C0603]
C245  C-EU-C0603  [C0603]  (not fitted in variant A)  (not fitted in variant B)  (not fitted in variant C)
C246  1u 25V  C-EU-1U-C0603  [C0603]
C247  C-EU-C0603  [C0603]  (not fitted in variant A)  (not fitted in variant B)  (not fitted in variant C)
C248  1u 25V  C-EU-1U-C0603  [C0603]
C249  C-EU-C0603  [C0603]  (not fitted in variant A)  (not fitted in variant B)  (not fitted in variant C)
C250  1u 25V  C-EU-1U-C0603  [C0603]
C251  C-EU-C0603  [C0603]  (not fitted in variant A)  (not fitted in variant B)  (not fitted in variant C)
C252  1u 25V  C-EU-1U-C0603  [C0603]
C253  C-EU-C0603  [C0603]  (not fitted in variant A)  (not fitted in variant B)  (not fitted in variant C)
C254  1u 25V  C-EU-1U-C0603  [C0603]
C255  C-EU-C0603  [C0603]  (not fitted in variant A)  (not fitted in variant B)  (not fitted in variant C)
C256  1u 25V  C-EU-1U-C0603  [C0603]
C257  C-EU-C0603  [C0603]  (not fitted in variant A)  (not fitted in variant B)  (not fitted in variant C)
C258  1u 25V  C-EU-1U-C0603  [C0603]
C259  C-EU-C0603  [C0603]  (not fitted in variant A)  (not fitted in variant B)  (not fitted in variant C)
C260  1u 25V  C-EU-1U-C0603  [C0603]
C261  C-EU-C0603  [C0603]  (not fitted in variant A)  (not fitted in variant B)  (not fitted in variant C)
C262  1u 25V  C-EU-1U-C0603  [C0603]
C263  C-EU-C0603  [C0603]  (not fitted in variant A)  (not fitted in variant B)  (not fitted in variant C)
C264  1u 25V  C-EU-1U-C0603  [C0603]
C265  C-EU-C0603  [C0603]  (not fitted in variant A)  (not fitted in variant B)  (not fitted in variant C)
C266  1u 25V  C-EU-1U-C0603  [C0603]
C270  1u 25V  C-EU-1U-C0603  [C0603]
C272  1u 25V  C-EU-1U-C0603  [C0603]
C280  1u 25V  C-EU-1U-C0603  [C0603]
C281  C-EU-C0603  [C0603]  (not fitted in variant A)  (not fitted in variant B)  (not fitted in variant C)
C282  1u 25V  C-EU-1U-C0603  [C0603]
C283  C-EU-C0603  [C0603]  (not fitted in variant A)  (not fitted in variant B)  (not fitted in variant C)
C284  1u 25V  C-EU-1U-C0603  [C0603]
C285  C-EU-C0603  [C0603]  (not fitted in variant A)  (not fitted in variant B)  (not fitted in variant C)
C286  1u 25V  C-EU-1U-C0603  [C0603]
C287  C-EU-C0603  [C0603]  (not fitted in variant A)  (not fitted in variant B)  (not fitted in variant C)
C288  1u 25V  C-EU-1U-C0603  [C0603]
C289  C-EU-C0603  [C0603]  (not fitted in variant A)  (not fitted in variant B)  (not fitted in variant C)
C290  1u 25V  C-EU-1U-C0603  [C0603]
C291  C-EU-C0603  [C0603]  (not fitted in variant A)  (not fitted in variant B)  (not fitted in variant C)
C292  1u 25V  C-EU-1U-C0603  [C0603]
C293  C-EU-C0603  [C0603]  (not fitted in variant A)  (not fitted in variant B)  (not fitted in variant C)
C294  1u 25V  C-EU-1U-C0603  [C0603]
C295  C-EU-C0603  [C0603]  (not fitted in variant A)  (not fitted in variant B)  (not fitted in variant C)
C296  1u 25V  C-EU-1U-C0603  [C0603]
C297  C-EU-C0603  [C0603]  (not fitted in variant A)  (not fitted in variant B)  (not fitted in variant C)
C298  1u 25V  C-EU-1U-C0603  [C0603]
C299  C-EU-C0603  [C0603]  (not fitted in variant A)  (not fitted in variant B)  (not fitted in variant C)
C300  1u 25V  C-EU-1U-C0603  [C0603]
C301  C-EU-C0603  [C0603]  (not fitted in variant A)  (not fitted in variant B)  (not fitted in variant C)
C302  1u 25V  C-EU-1U-C0603  [C0603]
C303  C-EU-C0603  [C0603]  (not fitted in variant A)  (not fitted in variant B)  (not fitted in variant C)
C304  1u 25V  C-EU-1U-C0603  [C0603]
C305  C-EU-C0603  [C0603]  (not fitted in variant A)  (not fitted in variant B)  (not fitted in variant C)
C306  1u 25V  C-EU-1U-C0603  [C0603]
C307  C-EU-C0603  [C0603]  (not fitted in variant A)  (not fitted in variant B)  (not fitted in variant C)
C308  1u 25V  C-EU-1U-C0603  [C0603]
C309  C-EU-C0603  [C0603]  (not fitted in variant A)  (not fitted in variant B)  (not fitted in variant C)
C310  1u 25V  C-EU-1U-C0603  [C0603]
C311  C-EU-C0603  [C0603]  (not fitted in variant A)  (not fitted in variant B)  (not fitted in variant C)
C312  1u 25V  C-EU-1U-C0603  [C0603]
C313  C-EU-C0603  [C0603]  (not fitted in variant A)  (not fitted in variant B)  (not fitted in variant C)
C314  1u 25V  C-EU-1U-C0603  [C0603]
C315  C-EU-C0603  [C0603]  (not fitted in variant A)  (not fitted in variant B)  (not fitted in variant C)
C316  1u 25V  C-EU-1U-C0603  [C0603]
C317  C-EU-C0603  [C0603]  (not fitted in variant A)  (not fitted in variant B)  (not fitted in variant C)
C318  1u 25V  C-EU-1U-C0603  [C0603]
C319  C-EU-C0603  [C0603]  (not fitted in variant A)  (not fitted in variant B)  (not fitted in variant C)
C320  1u 25V  C-EU-1U-C0603  [C0603]
C321  C-EU-C0603  [C0603]  (not fitted in variant A)  (not fitted in variant B)  (not fitted in variant C)
C322  1u 25V  C-EU-1U-C0603  [C0603]
C323  C-EU-C0603  [C0603]  (not fitted in variant A)  (not fitted in variant B)  (not fitted in variant C)
C324  1u 25V  C-EU-1U-C0603  [C0603]
C325  C-EU-C0603  [C0603]  (not fitted in variant A)  (not fitted in variant B)  (not fitted in variant C)
C326  1u 25V  C-EU-1U-C0603  [C0603]
C327  C-EU-C0603  [C0603]  (not fitted in variant A)  (not fitted in variant B)  (not fitted in variant C)
C328  1u 25V  C-EU-1U-C0603  [C0603]
C329  C-EU-C0603  [C0603]  (not fitted in variant A)  (not fitted in variant B)  (not fitted in variant C)
C330  1u 25V  C-EU-1U-C0603  [C0603]
C331  C-EU-C0603  [C0603]  (not fitted in variant A)  (not fitted in variant B)  (not fitted in variant C)
C332  1u 25V  C-EU-1U-C0603  [C0603]
D1  150060RS75000  [WL-SMCW_0603_WE]
D2  150060GS75000  [WL-SMCW_0603_WE]
D100  LZ1-00R302  LZ1-00R302-SMALL  [LZ1_SMALL_LEDENGIN]
D101  LZ1-00R302  LZ1-00R302-SMALL  [LZ1_SMALL_LEDENGIN]
D102  LZ1-00R302  LZ1-00R302-SMALL  [LZ1_SMALL_LEDENGIN]
D103  LZ1-00R302  LZ1-00R302-SMALL  [LZ1_SMALL_LEDENGIN]
D104  LZ1-00R302  LZ1-00R302-SMALL  [LZ1_SMALL_LEDENGIN]
D105  LZ1-00R302  LZ1-00R302-SMALL  [LZ1_SMALL_LEDENGIN]
D106  LZ1-00R302  LZ1-00R302-SMALL  [LZ1_SMALL_LEDENGIN]
D107  LZ1-00R302  LZ1-00R302-SMALL  [LZ1_SMALL_LEDENGIN]
D108  LZ1-00R302  LZ1-00R302-SMALL  [LZ1_SMALL_LEDENGIN]
D109  LZ1-00R302  LZ1-00R302-SMALL  [LZ1_SMALL_LEDENGIN]
D110  LZ1-00R302  LZ1-00R302-SMALL  [LZ1_SMALL_LEDENGIN]
D111  LZ1-00R302  LZ1-00R302-SMALL  [LZ1_SMALL_LEDENGIN]
D112  LZ1-00R302  LZ1-00R302-SMALL  [LZ1_SMALL_LEDENGIN]
D200  SST-10-IRD-B50-T850  [B50_LUMINUS]
D201  SST-10-IRD-B50-T850  [B50_LUMINUS]
D202  SST-10-IRD-B50-T850  [B50_LUMINUS]
D203  SST-10-IRD-B50-T850  [B50_LUMINUS]
D204  SST-10-IRD-B50-T850  [B50_LUMINUS]
D205  SST-10-IRD-B50-T850  [B50_LUMINUS]
D206  SST-10-IRD-B50-T850  [B50_LUMINUS]
D207  SST-10-IRD-B50-T850  [B50_LUMINUS]
D208  SST-10-IRD-B50-T850  [B50_LUMINUS]
D209  SST-10-IRD-B50-T850  [B50_LUMINUS]
D210  SST-10-IRD-B50-T850  [B50_LUMINUS]
D211  SST-10-IRD-B50-T850  [B50_LUMINUS]
D212  SST-10-IRD-B50-T850  [B50_LUMINUS]
D213  SST-10-IRD-B50-T850  [B50_LUMINUS]
D214  SST-10-IRD-B50-T850  [B50_LUMINUS]
D215  SST-10-IRD-B50-T850  [B50_LUMINUS]
D250  SST-10-IRD-B50-T850  [B50_LUMINUS]
D251  SST-10-IRD-B50-T850  [B50_LUMINUS]
D252  SST-10-IRD-B50-T850  [B50_LUMINUS]
D253  SST-10-IRD-B50-T850  [B50_LUMINUS]
D254  SST-10-IRD-B50-T850  [B50_LUMINUS]
D255  SST-10-IRD-B50-T850  [B50_LUMINUS]
D256  SST-10-IRD-B50-T850  [B50_LUMINUS]
D257  SST-10-IRD-B50-T850  [B50_LUMINUS]
D258  SST-10-IRD-B50-T850  [B50_LUMINUS]
D259  SST-10-IRD-B50-T850  [B50_LUMINUS]
D260  SST-10-IRD-B50-T850  [B50_LUMINUS]
D261  SST-10-IRD-B50-T850  [B50_LUMINUS]
D262  SST-10-IRD-B50-T850  [B50_LUMINUS]
D263  SST-10-IRD-B50-T850  [B50_LUMINUS]
D264  SST-10-IRD-B50-T850  [B50_LUMINUS]
D265  SST-10-IRD-B50-T850  [B50_LUMINUS]
D300  SST-10-IRD-B50-S940  [B50_LUMINUS]
D301  SST-10-IRD-B50-S940  [B50_LUMINUS]
D302  SST-10-IRD-B50-S940  [B50_LUMINUS]
D303  SST-10-IRD-B50-S940  [B50_LUMINUS]
D304  SST-10-IRD-B50-S940  [B50_LUMINUS]
D305  SST-10-IRD-B50-S940  [B50_LUMINUS]
D306  SST-10-IRD-B50-S940  [B50_LUMINUS]
D307  SST-10-IRD-B50-S940  [B50_LUMINUS]
D308  SST-10-IRD-B50-S940  [B50_LUMINUS]
D309  SST-10-IRD-B50-S940  [B50_LUMINUS]
D310  SST-10-IRD-B50-S940  [B50_LUMINUS]
D311  SST-10-IRD-B50-S940  [B50_LUMINUS]
D312  SST-10-IRD-B50-S940  [B50_LUMINUS]
D313  SST-10-IRD-B50-S940  [B50_LUMINUS]
D314  SST-10-IRD-B50-S940  [B50_LUMINUS]
D315  SST-10-IRD-B50-S940  [B50_LUMINUS]
D350  SST-10-IRD-B50-S940  [B50_LUMINUS]
D351  SST-10-IRD-B50-S940  [B50_LUMINUS]
D352  SST-10-IRD-B50-S940  [B50_LUMINUS]
D353  SST-10-IRD-B50-S940  [B50_LUMINUS]
D354  SST-10-IRD-B50-S940  [B50_LUMINUS]
D355  SST-10-IRD-B50-S940  [B50_LUMINUS]
D356  SST-10-IRD-B50-S940  [B50_LUMINUS]
D357  SST-10-IRD-B50-S940  [B50_LUMINUS]
D358  SST-10-IRD-B50-S940  [B50_LUMINUS]
D359  SST-10-IRD-B50-S940  [B50_LUMINUS]
D360  SST-10-IRD-B50-S940  [B50_LUMINUS]
D361  SST-10-IRD-B50-S940  [B50_LUMINUS]
D362  SST-10-IRD-B50-S940  [B50_LUMINUS]
D363  SST-10-IRD-B50-S940  [B50_LUMINUS]
D364  SST-10-IRD-B50-S940  [B50_LUMINUS]
D365  SST-10-IRD-B50-S940  [B50_LUMINUS]
IC1  UCC27517DBV  [DBV0005A_TI]
IC2  UCC27517DBV  [DBV0005A_TI]
IC3  LM393BIDSG  LM393BIDSG_NO_VIA  [DSG0008A_WSON_TI_NO_VIA]
IC4  LM393BIDSG  LM393BIDSG_NO_VIA  [DSG0008A_WSON_TI_NO_VIA]
IC5  LM393BIDSG  LM393BIDSG_NO_VIA  [DSG0008A_WSON_TI_NO_VIA]
IC7  VL53L1CBV0FY/1  [VL53L1X_STM]
IC8  UCC27517DBV  [DBV0005A_TI]
IC9  SN74LVC112ADGV  [TVSOP-16_TI]
IC10  UCC27517DBV  [DBV0005A_TI]
IC12  824001  [SOT23-6L_WE]
IC13  UCC27517DBV  [DBV0005A_TI]
IC14  824001  [SOT23-6L_WE]
IC15  TMP1075DGK  [S-PDSO-G8_DGK_VSSOP_TI]  (not fitted in variant A)  (not fitted in variant B)  (not fitted in variant C)
IC16  824001  [SOT23-6L_WE]
IC17  824001  [SOT23-6L_WE]
IC18  824001  [SOT23-6L_WE]
IC19  824001  [SOT23-6L_WE]
IC20  824001  [SOT23-6L_WE]
IC24  TMP112NAIDRL  [DRL0006A_TI]
IC25  BU27030NUC  [WSON008X2120_ROHM]
IC31  TLV71328PDBV  [R-PDSO-G5_DBV_TI]
IC100  SK6805-EC15  [SK6805-EC_IPIXEL]
IC101  SK6805-EC15  [SK6805-EC_IPIXEL]
IC102  SK6805-EC15  [SK6805-EC_IPIXEL]
IC103  SK6805-EC15  [SK6805-EC_IPIXEL]
IC104  SK6805-EC15  [SK6805-EC_IPIXEL]
IC105  SK6805-EC15  [SK6805-EC_IPIXEL]
IC106  SK6805-EC15  [SK6805-EC_IPIXEL]
IC107  SK6805-EC15  [SK6805-EC_IPIXEL]
IC108  SK6805-EC15  [SK6805-EC_IPIXEL]
IC109  SK6805-EC15  [SK6805-EC_IPIXEL]
IC110  SK6805-EC15  [SK6805-EC_IPIXEL]
IC111  SK6805-EC15  [SK6805-EC_IPIXEL]
IC112  SK6805-EC15  [SK6805-EC_IPIXEL]
IC113  SK6805-EC15  [SK6805-EC_IPIXEL]
IC114  SK6805-EC15  [SK6805-EC_IPIXEL]
IC115  SK6805-EC15  [SK6805-EC_IPIXEL]
IC116  SK6805-EC15  [SK6805-EC_IPIXEL]
IC117  SK6805-EC15  [SK6805-EC_IPIXEL]
IC118  SK6805-EC15  [SK6805-EC_IPIXEL]
IC119  SK6805-EC15  [SK6805-EC_IPIXEL]
IC120  SK6805-EC15  [SK6805-EC_IPIXEL]
IC121  SK6805-EC15  [SK6805-EC_IPIXEL]
IC122  SK6805-EC15  [SK6805-EC_IPIXEL]
IC123  SK6805-EC15  [SK6805-EC_IPIXEL]
IC124  SK6805-EC15  [SK6805-EC_IPIXEL]
IC125  SK6805-EC15  [SK6805-EC_IPIXEL]
IC126  SK6805-EC15  [SK6805-EC_IPIXEL]
IC127  SK6805-EC15  [SK6805-EC_IPIXEL]
IC128  SK6805-EC15  [SK6805-EC_IPIXEL]
IC129  SK6805-EC15  [SK6805-EC_IPIXEL]
IC130  SK6805-EC15  [SK6805-EC_IPIXEL]
IC131  SK6805-EC15  [SK6805-EC_IPIXEL]
IC132  SK6805-EC15  [SK6805-EC_IPIXEL]
IC133  SK6805-EC15  [SK6805-EC_IPIXEL]
IC134  SK6805-EC15  [SK6805-EC_IPIXEL]
IC135  SK6805-EC15  [SK6805-EC_IPIXEL]
IC136  SK6805-EC15  [SK6805-EC_IPIXEL]
IC137  SK6805-EC15  [SK6805-EC_IPIXEL]
IC138  SK6805-EC15  [SK6805-EC_IPIXEL]
IC139  SK6805-EC15  [SK6805-EC_IPIXEL]
IC140  SK6805-EC15  [SK6805-EC_IPIXEL]
IC141  SK6805-EC15  [SK6805-EC_IPIXEL]
IC142  SK6805-EC15  [SK6805-EC_IPIXEL]
IC143  SK6805-EC15  [SK6805-EC_IPIXEL]
IC144  SK6805-EC15  [SK6805-EC_IPIXEL]
IC145  SK6805-EC15  [SK6805-EC_IPIXEL]
IC146  SK6805-EC15  [SK6805-EC_IPIXEL]
IC147  SK6805-EC15  [SK6805-EC_IPIXEL]
IC148  SK6805-EC15  [SK6805-EC_IPIXEL]
IC149  SK6805-EC15  [SK6805-EC_IPIXEL]
IC150  SK6805-EC15  [SK6805-EC_IPIXEL]
IC151  SK6805-EC15  [SK6805-EC_IPIXEL]
IC152  SK6805-EC15  [SK6805-EC_IPIXEL]
IC153  SK6805-EC15  [SK6805-EC_IPIXEL]
IC154  SK6805-EC15  [SK6805-EC_IPIXEL]
IC155  SK6805-EC15  [SK6805-EC_IPIXEL]
IC156  SK6805-EC15  [SK6805-EC_IPIXEL]
IC157  SK6805-EC15  [SK6805-EC_IPIXEL]
IC158  SK6805-EC15  [SK6805-EC_IPIXEL]
IC159  SK6805-EC15  [SK6805-EC_IPIXEL]
IC160  SK6805-EC15  [SK6805-EC_IPIXEL]
IC161  SK6805-EC15  [SK6805-EC_IPIXEL]
IC162  SK6805-EC15  [SK6805-EC_IPIXEL]
IC163  SK6805-EC15  [SK6805-EC_IPIXEL]
IC164  SK6805-EC15  [SK6805-EC_IPIXEL]
IC165  SK6805-EC15  [SK6805-EC_IPIXEL]
IC166  SK6805-EC15  [SK6805-EC_IPIXEL]
IC167  SK6805-EC15  [SK6805-EC_IPIXEL]
IC168  SK6805-EC15  [SK6805-EC_IPIXEL]
IC169  SK6805-EC15  [SK6805-EC_IPIXEL]
IC170  SK6805-EC15  [SK6805-EC_IPIXEL]
IC171  SK6805-EC15  [SK6805-EC_IPIXEL]
IC172  SK6805-EC15  [SK6805-EC_IPIXEL]
IC173  SK6805-EC15  [SK6805-EC_IPIXEL]
IC174  SK6805-EC15  [SK6805-EC_IPIXEL]
IC175  SK6805-EC15  [SK6805-EC_IPIXEL]
IC176  SK6805-EC15  [SK6805-EC_IPIXEL]
IC177  SK6805-EC15  [SK6805-EC_IPIXEL]
IC178  SK6805-EC15  [SK6805-EC_IPIXEL]
IC179  SK6805-EC15  [SK6805-EC_IPIXEL]
IC180  SK6805-EC15  [SK6805-EC_IPIXEL]
IC181  SK6805-EC15  [SK6805-EC_IPIXEL]
IC182  SK6805-EC15  [SK6805-EC_IPIXEL]
IC183  SK6805-EC15  [SK6805-EC_IPIXEL]
IC184  SK6805-EC15  [SK6805-EC_IPIXEL]
IC185  SK6805-EC15  [SK6805-EC_IPIXEL]
IC186  SK6805-EC15  [SK6805-EC_IPIXEL]
IC187  SK6805-EC15  [SK6805-EC_IPIXEL]
IC188  SK6805-EC15  [SK6805-EC_IPIXEL]
IC189  SK6805-EC15  [SK6805-EC_IPIXEL]
IC190  SK6805-EC15  [SK6805-EC_IPIXEL]
IC191  SK6805-EC15  [SK6805-EC_IPIXEL]
IC192  SK6805-EC15  [SK6805-EC_IPIXEL]
IC193  SK6805-EC15  [SK6805-EC_IPIXEL]
IC194  SK6805-EC15  [SK6805-EC_IPIXEL]
IC195  SK6805-EC15  [SK6805-EC_IPIXEL]
IC196  SK6805-EC15  [SK6805-EC_IPIXEL]
IC197  SK6805-EC15  [SK6805-EC_IPIXEL]
IC198  SK6805-EC15  [SK6805-EC_IPIXEL]
IC199  SK6805-EC15  [SK6805-EC_IPIXEL]
IC200  SK6805-EC15  [SK6805-EC_IPIXEL]
IC201  SK6805-EC15  [SK6805-EC_IPIXEL]
IC202  SK6805-EC15  [SK6805-EC_IPIXEL]
IC203  SK6805-EC15  [SK6805-EC_IPIXEL]
IC204  SK6805-EC15  [SK6805-EC_IPIXEL]
IC205  SK6805-EC15  [SK6805-EC_IPIXEL]
IC206  SK6805-EC15  [SK6805-EC_IPIXEL]
IC207  SK6805-EC15  [SK6805-EC_IPIXEL]
IC208  SK6805-EC15  [SK6805-EC_IPIXEL]
IC209  SK6805-EC15  [SK6805-EC_IPIXEL]
IC210  SK6805-EC15  [SK6805-EC_IPIXEL]
IC211  SK6805-EC15  [SK6805-EC_IPIXEL]
IC212  SK6805-EC15  [SK6805-EC_IPIXEL]
IC213  SK6805-EC15  [SK6805-EC_IPIXEL]
IC214  SK6805-EC15  [SK6805-EC_IPIXEL]
IC215  SK6805-EC15  [SK6805-EC_IPIXEL]
IC216  SK6805-EC15  [SK6805-EC_IPIXEL]
IC217  SK6805-EC15  [SK6805-EC_IPIXEL]
IC218  SK6805-EC15  [SK6805-EC_IPIXEL]
IC219  SK6805-EC15  [SK6805-EC_IPIXEL]
IC220  SK6805-EC15  [SK6805-EC_IPIXEL]
IC221  SK6805-EC15  [SK6805-EC_IPIXEL]
IC222  SK6805-EC15  [SK6805-EC_IPIXEL]
IC223  SK6805-EC15  [SK6805-EC_IPIXEL]
IC224  SK6805-EC15  [SK6805-EC_IPIXEL]
IC225  SK6805-EC15  [SK6805-EC_IPIXEL]
IC226  SK6805-EC15  [SK6805-EC_IPIXEL]
IC227  SK6805-EC15  [SK6805-EC_IPIXEL]
IC228  SK6805-EC15  [SK6805-EC_IPIXEL]
IC229  SK6805-EC15  [SK6805-EC_IPIXEL]
IC230  SK6805-EC15  [SK6805-EC_IPIXEL]
IC231  SK6805-EC15  [SK6805-EC_IPIXEL]
IC232  SK6805-EC15  [SK6805-EC_IPIXEL]
IC233  SK6805-EC15  [SK6805-EC_IPIXEL]
IC234  SK6805-EC15  [SK6805-EC_IPIXEL]
IC235  SK6805-EC15  [SK6805-EC_IPIXEL]
IC236  SK6805-EC15  [SK6805-EC_IPIXEL]
IC237  SK6805-EC15  [SK6805-EC_IPIXEL]
IC238  SK6805-EC15  [SK6805-EC_IPIXEL]
IC239  SK6805-EC15  [SK6805-EC_IPIXEL]
IC240  SK6805-EC15  [SK6805-EC_IPIXEL]
IC241  SK6805-EC15  [SK6805-EC_IPIXEL]
IC242  SK6805-EC15  [SK6805-EC_IPIXEL]
IC243  SK6805-EC15  [SK6805-EC_IPIXEL]
IC244  SK6805-EC15  [SK6805-EC_IPIXEL]
IC245  SK6805-EC15  [SK6805-EC_IPIXEL]
IC246  SK6805-EC15  [SK6805-EC_IPIXEL]
IC247  SK6805-EC15  [SK6805-EC_IPIXEL]
IC248  SK6805-EC15  [SK6805-EC_IPIXEL]
IC249  SK6805-EC15  [SK6805-EC_IPIXEL]
IC250  SK6805-EC15  [SK6805-EC_IPIXEL]
IC251  SK6805-EC15  [SK6805-EC_IPIXEL]
IC252  SK6805-EC15  [SK6805-EC_IPIXEL]
IC253  SK6805-EC15  [SK6805-EC_IPIXEL]
IC254  SK6805-EC15  [SK6805-EC_IPIXEL]
IC255  SK6805-EC15  [SK6805-EC_IPIXEL]
IC256  SK6805-EC15  [SK6805-EC_IPIXEL]
IC257  SK6805-EC15  [SK6805-EC_IPIXEL]
IC258  SK6805-EC15  [SK6805-EC_IPIXEL]
IC259  SK6805-EC15  [SK6805-EC_IPIXEL]
IC260  SK6805-EC15  [SK6805-EC_IPIXEL]
IC261  SK6805-EC15  [SK6805-EC_IPIXEL]
IC262  SK6805-EC15  [SK6805-EC_IPIXEL]
IC263  SK6805-EC15  [SK6805-EC_IPIXEL]
IC264  SK6805-EC15  [SK6805-EC_IPIXEL]
IC265  SK6805-EC15  [SK6805-EC_IPIXEL]
IC266  SK6805-EC15  [SK6805-EC_IPIXEL]
IC267  SK6805-EC15  [SK6805-EC_IPIXEL]
IC268  SK6805-EC15  [SK6805-EC_IPIXEL]
IC269  SK6805-EC15  [SK6805-EC_IPIXEL]
IC270  SK6805-EC15  [SK6805-EC_IPIXEL]
IC271  SK6805-EC15  [SK6805-EC_IPIXEL]
IC272  SK6805-EC15  [SK6805-EC_IPIXEL]
IC273  SK6805-EC15  [SK6805-EC_IPIXEL]
IC274  SK6805-EC15  [SK6805-EC_IPIXEL]
IC275  SK6805-EC15  [SK6805-EC_IPIXEL]
IC276  SK6805-EC15  [SK6805-EC_IPIXEL]
IC277  SK6805-EC15  [SK6805-EC_IPIXEL]
IC278  SK6805-EC15  [SK6805-EC_IPIXEL]
IC279  SK6805-EC15  [SK6805-EC_IPIXEL]
IC280  SK6805-EC15  [SK6805-EC_IPIXEL]
IC281  SK6805-EC15  [SK6805-EC_IPIXEL]
IC282  SK6805-EC15  [SK6805-EC_IPIXEL]
IC283  SK6805-EC15  [SK6805-EC_IPIXEL]
IC284  SK6805-EC15  [SK6805-EC_IPIXEL]
IC285  SK6805-EC15  [SK6805-EC_IPIXEL]
IC286  SK6805-EC15  [SK6805-EC_IPIXEL]
IC287  SK6805-EC15  [SK6805-EC_IPIXEL]
IC288  SK6805-EC15  [SK6805-EC_IPIXEL]
IC289  SK6805-EC15  [SK6805-EC_IPIXEL]
IC290  SK6805-EC15  [SK6805-EC_IPIXEL]
IC291  SK6805-EC15  [SK6805-EC_IPIXEL]
IC292  SK6805-EC15  [SK6805-EC_IPIXEL]
IC293  SK6805-EC15  [SK6805-EC_IPIXEL]
IC294  SK6805-EC15  [SK6805-EC_IPIXEL]
IC295  SK6805-EC15  [SK6805-EC_IPIXEL]
IC296  SK6805-EC15  [SK6805-EC_IPIXEL]
IC297  SK6805-EC15  [SK6805-EC_IPIXEL]
IC298  SK6805-EC15  [SK6805-EC_IPIXEL]
IC299  SK6805-EC15  [SK6805-EC_IPIXEL]
IC300  SK6805-EC15  [SK6805-EC_IPIXEL]
IC301  SK6805-EC15  [SK6805-EC_IPIXEL]
IC302  SK6805-EC15  [SK6805-EC_IPIXEL]
IC303  SK6805-EC15  [SK6805-EC_IPIXEL]
IC304  SK6805-EC15  [SK6805-EC_IPIXEL]
IC305  SK6805-EC15  [SK6805-EC_IPIXEL]
IC306  SK6805-EC15  [SK6805-EC_IPIXEL]
IC307  SK6805-EC15  [SK6805-EC_IPIXEL]
IC308  SK6805-EC15  [SK6805-EC_IPIXEL]
IC309  SK6805-EC15  [SK6805-EC_IPIXEL]
IC310  SK6805-EC15  [SK6805-EC_IPIXEL]
IC311  SK6805-EC15  [SK6805-EC_IPIXEL]
IC312  SK6805-EC15  [SK6805-EC_IPIXEL]
IC313  SK6805-EC15  [SK6805-EC_IPIXEL]
IC314  SK6805-EC15  [SK6805-EC_IPIXEL]
IC315  SK6805-EC15  [SK6805-EC_IPIXEL]
IC316  SK6805-EC15  [SK6805-EC_IPIXEL]
IC317  SK6805-EC15  [SK6805-EC_IPIXEL]
IC318  SK6805-EC15  [SK6805-EC_IPIXEL]
IC319  SK6805-EC15  [SK6805-EC_IPIXEL]
IC320  SK6805-EC15  [SK6805-EC_IPIXEL]
IC321  SK6805-EC15  [SK6805-EC_IPIXEL]
IC322  SK6805-EC15  [SK6805-EC_IPIXEL]
IC323  SK6805-EC15  [SK6805-EC_IPIXEL]
IC324  SK6805-EC15  [SK6805-EC_IPIXEL]
IC325  SK6805-EC15  [SK6805-EC_IPIXEL]
IC326  SK6805-EC15  [SK6805-EC_IPIXEL]
IC327  SK6805-EC15  [SK6805-EC_IPIXEL]
IC328  SK6805-EC15  [SK6805-EC_IPIXEL]
IC329  SK6805-EC15  [SK6805-EC_IPIXEL]
IC330  SK6805-EC15  [SK6805-EC_IPIXEL]
IC331  SK6805-EC15  [SK6805-EC_IPIXEL]
IC332  SK6805-EC15  [SK6805-EC_IPIXEL]
L9  74279269  [FERRIT_0603_WIDE_BAND_WUERTH]
L11  742792097  [FERRIT_0805_WUERTH]
L14  742792097  [FERRIT_0805_WUERTH]
PS1  PASSERMARKE  [PASSERMARKE]
PS2  PASSERMARKE  [PASSERMARKE]
PS3  PASSERMARKE  [PASSERMARKE]
PS4  PASSERMARKE  [PASSERMARKE]
PS5  PASSERMARKE  [PASSERMARKE]
PS6  PASSERMARKE  [PASSERMARKE]
R1  0R  R-EU-0R-R0603  [R0603]
R2  10k  R-EU-10K-R0603  [R0603]
R3  56k  R-EU-56K-R0603  [R0603]
R4  56k  R-EU-56K-R0603  [R0603]
R5  56k  R-EU-56K-R0603  [R0603]
R6  56k  R-EU-56K-R0603  [R0603]
R7  15R 0W75  R-EU-CRCW121015R0FKEAHP-R1210  [R1210]
R8  3R9 0W75  R-EU-CRCW12103R90FKEAHP-R1210  [R1210]  (variant B: 5R6 0W75)  (variant C: 5R49 0W75)
R9  0R  R-EU-0R-R0603  [R0603]
R10  56k  R-EU-56K-R0603  [R0603]
R11  56k  R-EU-56K-R0603  [R0603]
R12  56k  R-EU-56K-R0603  [R0603]
R13  56k  R-EU-56K-R0603  [R0603]
R15  3R9 0W75  R-EU-CRCW12103R90FKEAHP-R1210  [R1210]  (variant B: 5R6 0W75)  (variant C: 5R49 0W75)
R16  0R  R-EU-0R-R0603  [R0603]
R17  91k  R-EU-91K-R0603  [R0603]
R18  27k  R-EU-27K-R0603  [R0603]
R19  0R  R-EU-0R-R0603  [R0603]
R20  3R9 0W75  R-EU-CRCW12103R90FKEAHP-R1210  [R1210]  (variant B: 5R6 0W75)  (variant C: 5R49 0W75)
R21  27R  R-EU-27R-R0603  [R0603]
R22  3R9 0W75  R-EU-CRCW12103R90FKEAHP-R1210  [R1210]  (variant B: 5R6 0W75)  (variant C: 5R49 0W75)
R23  27R  R-EU-27R-R0603  [R0603]
R24  27R  R-EU-27R-R0603  [R0603]
R25  3R9 0W75  R-EU-CRCW12103R90FKEAHP-R1210  [R1210]  (variant B: 5R6 0W75)  (variant C: 5R49 0W75)
R26  0R  R-EU-0R-R0603  [R0603]
R27  0R  R-EU-0R-R0603  [R0603]
R28  0R  R-EU-0R-R0603  [R0603]
R29  3R9 0W75  R-EU-CRCW12103R90FKEAHP-R1210  [R1210]  (variant B: 5R6 0W75)  (variant C: 5R49 0W75)
R30  27R  R-EU-27R-R0603  [R0603]
R31  10k  R-EU-10K-R0603  [R0603]
R32  27R  R-EU-27R-R0603  [R0603]
R33  27R  R-EU-27R-R0603  [R0603]
R34  3R9 0W75  R-EU-CRCW12103R90FKEAHP-R1210  [R1210]  (variant B: 5R6 0W75)  (variant C: 5R49 0W75)
R35  3R9 0W75  R-EU-CRCW12103R90FKEAHP-R1210  [R1210]  (variant B: 5R6 0W75)  (variant C: 5R49 0W75)
R37  27R  R-EU-27R-R0603  [R0603]
R38  0R  R-EU-0R-R0603  [R0603]
R39  27R  R-EU-27R-R0603  [R0603]
R40  10k  R-EU-10K-R0603  [R0603]
R43  3R9 0W75  R-EU-CRCW12103R90FKEAHP-R1210  [R1210]  (variant B: 5R6 0W75)  (variant C: 5R49 0W75)
R44  0R  R-EU-0R-R0603  [R0603]
R46  3R9 0W75  R-EU-CRCW12103R90FKEAHP-R1210  [R1210]  (variant B: 5R6 0W75)  (variant C: 5R49 0W75)
R47  0R  R-EU-0R-R0603  [R0603]
R49  0R  R-EU-0R-R0603  [R0603]
R52  3R9 0W75  R-EU-CRCW12103R90FKEAHP-R1210  [R1210]  (variant B: 5R6 0W75)  (variant C: 5R49 0W75)
R54  27R  R-EU-27R-R0603  [R0603]
R55  27R  R-EU-27R-R0603  [R0603]
R56  27R  R-EU-27R-R0603  [R0603]
R57  3R9 0W75  R-EU-CRCW12103R90FKEAHP-R1210  [R1210]  (variant B: 5R6 0W75)  (variant C: 5R49 0W75)
R59  27R  R-EU-27R-R0603  [R0603]
R60  56k  R-EU-56K-R0603  [R0603]
R62  1k1  R-EU-1K1-R0603  [R0603]
R64  56k  R-EU-56K-R0603  [R0603]
R66  3R9 0W75  R-EU-CRCW12103R90FKEAHP-R1210  [R1210]  (variant B: 5R6 0W75)  (variant C: 5R49 0W75)
R67  10k  R-EU-10K-R0603  [R0603]
R69  3R9 0W75  R-EU-CRCW12103R90FKEAHP-R1210  [R1210]  (variant B: 5R6 0W75)  (variant C: 5R49 0W75)
R70  R-EU-R0603  [R0603]  (not fitted in variant A)  (not fitted in variant B)  (not fitted in variant C)
R71  R-EU-R0603  [R0603]  (not fitted in variant A)  (not fitted in variant B)  (not fitted in variant C)
R72  0R  R-EU-0R-R0603  [R0603]
R73  3R9 0W75  R-EU-CRCW12103R90FKEAHP-R1210  [R1210]  (variant B: 5R6 0W75)  (variant C: 5R49 0W75)
R75  3R9 0W75  R-EU-CRCW12103R90FKEAHP-R1210  [R1210]  (variant B: 5R6 0W75)  (variant C: 5R49 0W75)
R76  0R  R-EU-0R-R0603  [R0603]
R78  0R  R-EU-0R-R0603  [R0603]
R79  0R  R-EU-0R-R0603  [R0603]
R80  27R  R-EU-27R-R0603  [R0603]
R81  27R  R-EU-27R-R0603  [R0603]
R82  27R  R-EU-27R-R0603  [R0603]
R83  15R 0W75  R-EU-CRCW121015R0FKEAHP-R1210  [R1210]
R84  15R 0W75  R-EU-CRCW121015R0FKEAHP-R1210  [R1210]
R87  100R  R-EU-100R-R0603  [R0603]
SW1  ATE-1C-V  [ATE-1C_DIPTRONICS]
T2  PMV30ENEA  [SOT-23_NXP]
T3  PMV30ENEA  [SOT-23_NXP]
T6  PMV30ENEA  [SOT-23_NXP]
T7  PMV30ENEA  [SOT-23_NXP]
T8  NX7002AK  [SOT-23_NXP]
T10  PMV30ENEA  [SOT-23_NXP]
TP1  GND  TESTPOINT_ROUND_1.5MM  [TESTPAD_ROUND_1.5MM]
TP2  +PVCC  TESTPOINT_ROUND_1.5MM  [TESTPAD_ROUND_1.5MM]
TP3  TESTPOINT_ROUND_1.5MM  [TESTPAD_ROUND_1.5MM]
TP4  TESTPOINT_ROUND_1.5MM  [TESTPAD_ROUND_1.5MM]
TP5  TESTPOINT_ROUND_1.5MM  [TESTPAD_ROUND_1.5MM]
TP6  TESTPOINT_ROUND_1.5MM  [TESTPAD_ROUND_1.5MM]
TP7  TESTPOINT_ROUND_1.5MM  [TESTPAD_ROUND_1.5MM]
TP8  TESTPOINT_ROUND_1.5MM  [TESTPAD_ROUND_1.5MM]
TP9  TESTPOINT_ROUND_1.5MM  [TESTPAD_ROUND_1.5MM]
TP10  TESTPOINT_ROUND_1.5MM  [TESTPAD_ROUND_1.5MM]
TP11  TESTPOINT_ROUND_1.5MM  [TESTPAD_ROUND_1.5MM]
TP12  TESTPOINT_ROUND_1.5MM  [TESTPAD_ROUND_1.5MM]
TP13  SAFETY_SHDN_RST  TESTPOINT_ROUND_1.5MM  [TESTPAD_ROUND_1.5MM]
TP14  TESTPOINT_ROUND_1.5MM  [TESTPAD_ROUND_1.5MM]
TP15  TESTPOINT_ROUND_1.5MM  [TESTPAD_ROUND_1.5MM]
TP16  TESTPOINT_ROUND_1.5MM  [TESTPAD_ROUND_1.5MM]
TP17  TESTPOINT_ROUND_1.5MM  [TESTPAD_ROUND_1.5MM]
TP18  TESTPOINT_ROUND_1.5MM  [TESTPAD_ROUND_1.5MM]
TP19  TESTPOINT_ROUND_1.5MM  [TESTPAD_ROUND_1.5MM]
TP20  TESTPOINT_ROUND_1.5MM  [TESTPAD_ROUND_1.5MM]
TP21  TESTPOINT_ROUND_1.5MM  [TESTPAD_ROUND_1.5MM]
TP22  TESTPOINT_ROUND_1.5MM  [TESTPAD_ROUND_1.5MM]
TP23  TESTPOINT_ROUND_1.5MM  [TESTPAD_ROUND_1.5MM]
X1  MEC6-120-02-L-DV-A  [MEC6-120-02]
X2  MEC6-120-02-L-DV-A  [MEC6-120-02]
X3  DF37NC-30DS-0.4V  [DF37NC-30DS-0.4V]
X4  687112182122  [687112182122_WUERTH]
X5  AXE530127  [AXE530127_PANASONIC]